# Altium project Project-C_LED.PrjPCB (part 2 of 2)
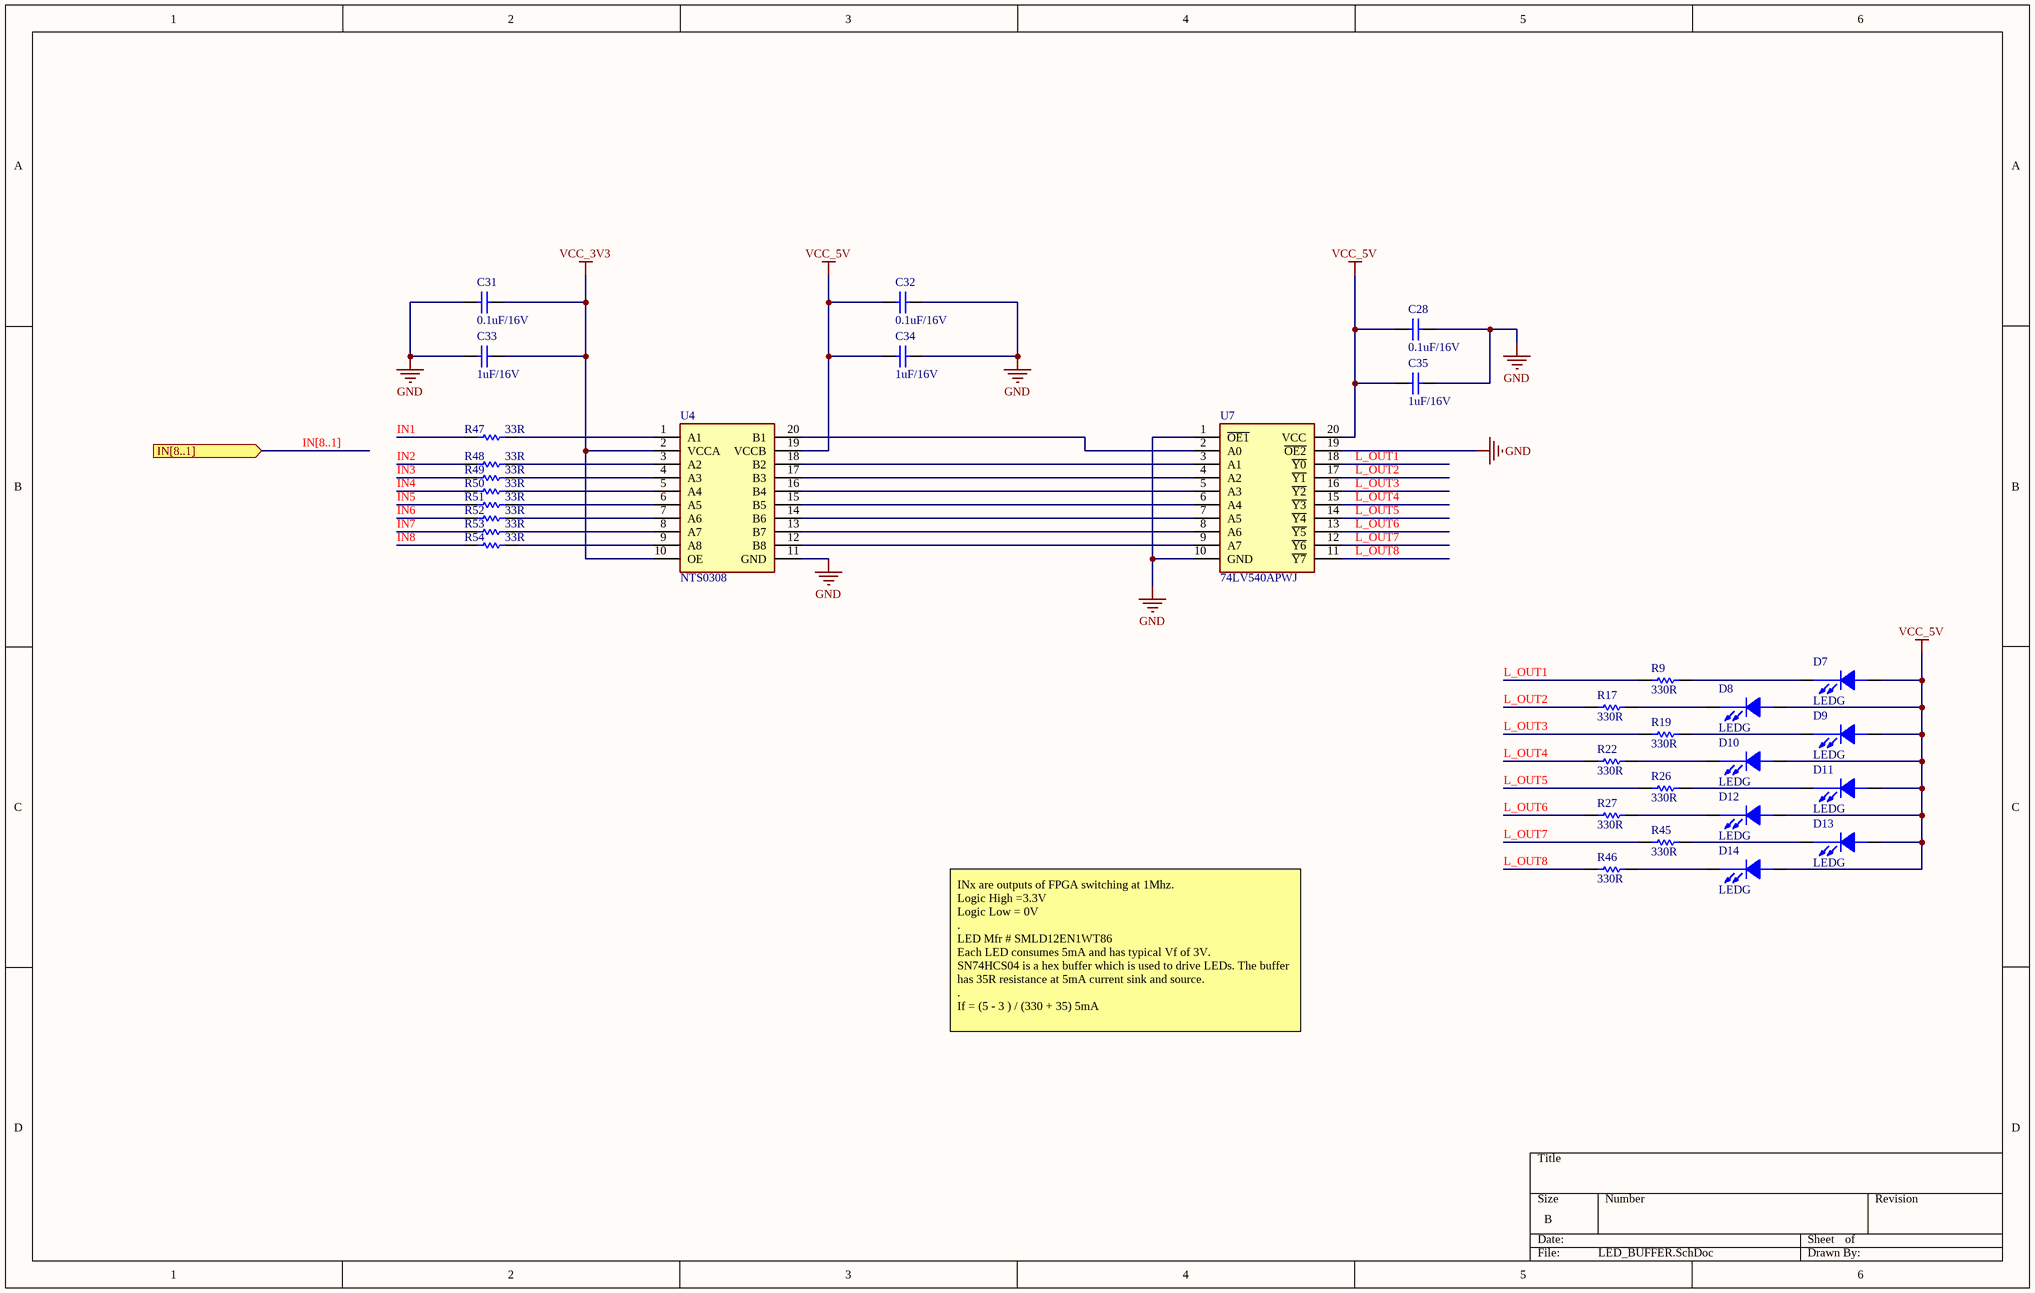
[diagram p8: LED_BUFFER.SchDoc]

## Nets that join several sheets
GND: TOP_LED (27 pins), F1/IO (19 pins), F1/POWER (42 pins), Power (11 pins), F2/IO (19 pins), F2/POWER (42 pins), F3/IO (19 pins), F3/POWER (42 pins), F4/IO (19 pins), F4/POWER (42 pins), Power_ORing (14 pins), U_LED_BUFFER_1xFPGA1/U_LED_BUFFER1 (10 pins), U_LED_BUFFER_1xFPGA1/U_LED_BUFFER2 (10 pins), U_LED_BUFFER_1xFPGA1/U_LED_BUFFER3 (10 pins), U_LED_BUFFER_1xFPGA1/U_LED_BUFFER4 (10 pins), U_LED_BUFFER_1xFPGA1/U_LED_BUFFER5 (10 pins), U_LED_BUFFER_1xFPGA1/U_LED_BUFFER6 (10 pins), U_LED_BUFFER_1xFPGA1/U_LED_BUFFER7 (10 pins), U_LED_BUFFER_1xFPGA1/U_LED_BUFFER8 (10 pins), U_LED_BUFFER_1xFPGA1/U_LED_BUFFER9 (10 pins), U_LED_BUFFER_1xFPGA1/U_LED_BUFFER10 (10 pins), U_LED_BUFFER_1xFPGA2/U_LED_BUFFER1 (10 pins), U_LED_BUFFER_1xFPGA2/U_LED_BUFFER2 (10 pins), U_LED_BUFFER_1xFPGA2/U_LED_BUFFER3 (10 pins), U_LED_BUFFER_1xFPGA2/U_LED_BUFFER4 (10 pins), U_LED_BUFFER_1xFPGA2/U_LED_BUFFER5 (10 pins), U_LED_BUFFER_1xFPGA2/U_LED_BUFFER6 (10 pins), U_LED_BUFFER_1xFPGA2/U_LED_BUFFER7 (10 pins), U_LED_BUFFER_1xFPGA2/U_LED_BUFFER8 (10 pins), U_LED_BUFFER_1xFPGA2/U_LED_BUFFER9 (10 pins), U_LED_BUFFER_1xFPGA2/U_LED_BUFFER10 (10 pins), U_LED_BUFFER_1xFPGA3/U_LED_BUFFER1 (10 pins), U_LED_BUFFER_1xFPGA3/U_LED_BUFFER2 (10 pins), U_LED_BUFFER_1xFPGA3/U_LED_BUFFER3 (10 pins), U_LED_BUFFER_1xFPGA3/U_LED_BUFFER4 (10 pins), U_LED_BUFFER_1xFPGA3/U_LED_BUFFER5 (10 pins), U_LED_BUFFER_1xFPGA3/U_LED_BUFFER6 (10 pins), U_LED_BUFFER_1xFPGA3/U_LED_BUFFER7 (10 pins), U_LED_BUFFER_1xFPGA3/U_LED_BUFFER8 (10 pins), U_LED_BUFFER_1xFPGA3/U_LED_BUFFER9 (10 pins), U_LED_BUFFER_1xFPGA3/U_LED_BUFFER10 (10 pins), U_LED_BUFFER_1xFPGA4/U_LED_BUFFER1 (10 pins), U_LED_BUFFER_1xFPGA4/U_LED_BUFFER2 (10 pins), U_LED_BUFFER_1xFPGA4/U_LED_BUFFER3 (10 pins), U_LED_BUFFER_1xFPGA4/U_LED_BUFFER4 (10 pins), U_LED_BUFFER_1xFPGA4/U_LED_BUFFER5 (10 pins), U_LED_BUFFER_1xFPGA4/U_LED_BUFFER6 (10 pins), U_LED_BUFFER_1xFPGA4/U_LED_BUFFER7 (10 pins), U_LED_BUFFER_1xFPGA4/U_LED_BUFFER8 (10 pins), U_LED_BUFFER_1xFPGA4/U_LED_BUFFER9 (10 pins), U_LED_BUFFER_1xFPGA4/U_LED_BUFFER10 (10 pins)
PWR_CNTRL: TOP_LED (J1.7 J1.8), Power_ORing (6 pins)
VCC_3V3: TOP_LED (7 pins), F1/IO (C1_F1_IO.2 U1_F1_IO.1 U1_F1_IO.4), F1/POWER (L1_F1_POWER.1 L3_F1_POWER.1), Power (C30.2 U6.4), F2/IO (C1_F2_IO.2 U1_F2_IO.1 U1_F2_IO.4), F2/POWER (L1_F2_POWER.1 L3_F2_POWER.1), F3/IO (C1_F3_IO.2 U1_F3_IO.1 U1_F3_IO.4), F3/POWER (L1_F3_POWER.1 L3_F3_POWER.1), F4/IO (C1_F4_IO.2 U1_F4_IO.1 U1_F4_IO.4), F4/POWER (L1_F4_POWER.1 L3_F4_POWER.1), U_LED_BUFFER_1xFPGA1/U_LED_BUFFER1 (C31_U_LED_BUFFER_1xFPGA1_U_LED_BUFFER1.2 C33_U_LED_BUFFER_1xFPGA1_U_LED_BUFFER1.2 U4_U_LED_BUFFER_1xFPGA1_U_LED_BUFFER1.2 U4_U_LED_BUFFER_1xFPGA1_U_LED_BUFFER1.10), U_LED_BUFFER_1xFPGA1/U_LED_BUFFER2 (C31_U_LED_BUFFER_1xFPGA1_U_LED_BUFFER2.2 C33_U_LED_BUFFER_1xFPGA1_U_LED_BUFFER2.2 U4_U_LED_BUFFER_1xFPGA1_U_LED_BUFFER2.2 U4_U_LED_BUFFER_1xFPGA1_U_LED_BUFFER2.10), U_LED_BUFFER_1xFPGA1/U_LED_BUFFER3 (C31_U_LED_BUFFER_1xFPGA1_U_LED_BUFFER3.2 C33_U_LED_BUFFER_1xFPGA1_U_LED_BUFFER3.2 U4_U_LED_BUFFER_1xFPGA1_U_LED_BUFFER3.2 U4_U_LED_BUFFER_1xFPGA1_U_LED_BUFFER3.10), U_LED_BUFFER_1xFPGA1/U_LED_BUFFER4 (C31_U_LED_BUFFER_1xFPGA1_U_LED_BUFFER4.2 C33_U_LED_BUFFER_1xFPGA1_U_LED_BUFFER4.2 U4_U_LED_BUFFER_1xFPGA1_U_LED_BUFFER4.2 U4_U_LED_BUFFER_1xFPGA1_U_LED_BUFFER4.10), U_LED_BUFFER_1xFPGA1/U_LED_BUFFER5 (C31_U_LED_BUFFER_1xFPGA1_U_LED_BUFFER5.2 C33_U_LED_BUFFER_1xFPGA1_U_LED_BUFFER5.2 U4_U_LED_BUFFER_1xFPGA1_U_LED_BUFFER5.2 U4_U_LED_BUFFER_1xFPGA1_U_LED_BUFFER5.10), U_LED_BUFFER_1xFPGA1/U_LED_BUFFER6 (C31_U_LED_BUFFER_1xFPGA1_U_LED_BUFFER6.2 C33_U_LED_BUFFER_1xFPGA1_U_LED_BUFFER6.2 U4_U_LED_BUFFER_1xFPGA1_U_LED_BUFFER6.2 U4_U_LED_BUFFER_1xFPGA1_U_LED_BUFFER6.10), U_LED_BUFFER_1xFPGA1/U_LED_BUFFER7 (C31_U_LED_BUFFER_1xFPGA1_U_LED_BUFFER7.2 C33_U_LED_BUFFER_1xFPGA1_U_LED_BUFFER7.2 U4_U_LED_BUFFER_1xFPGA1_U_LED_BUFFER7.2 U4_U_LED_BUFFER_1xFPGA1_U_LED_BUFFER7.10), U_LED_BUFFER_1xFPGA1/U_LED_BUFFER8 (C31_U_LED_BUFFER_1xFPGA1_U_LED_BUFFER8.2 C33_U_LED_BUFFER_1xFPGA1_U_LED_BUFFER8.2 U4_U_LED_BUFFER_1xFPGA1_U_LED_BUFFER8.2 U4_U_LED_BUFFER_1xFPGA1_U_LED_BUFFER8.10), U_LED_BUFFER_1xFPGA1/U_LED_BUFFER9 (C31_U_LED_BUFFER_1xFPGA1_U_LED_BUFFER9.2 C33_U_LED_BUFFER_1xFPGA1_U_LED_BUFFER9.2 U4_U_LED_BUFFER_1xFPGA1_U_LED_BUFFER9.2 U4_U_LED_BUFFER_1xFPGA1_U_LED_BUFFER9.10), U_LED_BUFFER_1xFPGA1/U_LED_BUFFER10 (C31_U_LED_BUFFER_1xFPGA1_U_LED_BUFFER10.2 C33_U_LED_BUFFER_1xFPGA1_U_LED_BUFFER10.2 U4_U_LED_BUFFER_1xFPGA1_U_LED_BUFFER10.2 U4_U_LED_BUFFER_1xFPGA1_U_LED_BUFFER10.10), U_LED_BUFFER_1xFPGA2/U_LED_BUFFER1 (C31_U_LED_BUFFER_1xFPGA2_U_LED_BUFFER1.2 C33_U_LED_BUFFER_1xFPGA2_U_LED_BUFFER1.2 U4_U_LED_BUFFER_1xFPGA2_U_LED_BUFFER1.2 U4_U_LED_BUFFER_1xFPGA2_U_LED_BUFFER1.10), U_LED_BUFFER_1xFPGA2/U_LED_BUFFER2 (C31_U_LED_BUFFER_1xFPGA2_U_LED_BUFFER2.2 C33_U_LED_BUFFER_1xFPGA2_U_LED_BUFFER2.2 U4_U_LED_BUFFER_1xFPGA2_U_LED_BUFFER2.2 U4_U_LED_BUFFER_1xFPGA2_U_LED_BUFFER2.10), U_LED_BUFFER_1xFPGA2/U_LED_BUFFER3 (C31_U_LED_BUFFER_1xFPGA2_U_LED_BUFFER3.2 C33_U_LED_BUFFER_1xFPGA2_U_LED_BUFFER3.2 U4_U_LED_BUFFER_1xFPGA2_U_LED_BUFFER3.2 U4_U_LED_BUFFER_1xFPGA2_U_LED_BUFFER3.10), U_LED_BUFFER_1xFPGA2/U_LED_BUFFER4 (C31_U_LED_BUFFER_1xFPGA2_U_LED_BUFFER4.2 C33_U_LED_BUFFER_1xFPGA2_U_LED_BUFFER4.2 U4_U_LED_BUFFER_1xFPGA2_U_LED_BUFFER4.2 U4_U_LED_BUFFER_1xFPGA2_U_LED_BUFFER4.10), U_LED_BUFFER_1xFPGA2/U_LED_BUFFER5 (C31_U_LED_BUFFER_1xFPGA2_U_LED_BUFFER5.2 C33_U_LED_BUFFER_1xFPGA2_U_LED_BUFFER5.2 U4_U_LED_BUFFER_1xFPGA2_U_LED_BUFFER5.2 U4_U_LED_BUFFER_1xFPGA2_U_LED_BUFFER5.10), U_LED_BUFFER_1xFPGA2/U_LED_BUFFER6 (C31_U_LED_BUFFER_1xFPGA2_U_LED_BUFFER6.2 C33_U_LED_BUFFER_1xFPGA2_U_LED_BUFFER6.2 U4_U_LED_BUFFER_1xFPGA2_U_LED_BUFFER6.2 U4_U_LED_BUFFER_1xFPGA2_U_LED_BUFFER6.10), U_LED_BUFFER_1xFPGA2/U_LED_BUFFER7 (C31_U_LED_BUFFER_1xFPGA2_U_LED_BUFFER7.2 C33_U_LED_BUFFER_1xFPGA2_U_LED_BUFFER7.2 U4_U_LED_BUFFER_1xFPGA2_U_LED_BUFFER7.2 U4_U_LED_BUFFER_1xFPGA2_U_LED_BUFFER7.10), U_LED_BUFFER_1xFPGA2/U_LED_BUFFER8 (C31_U_LED_BUFFER_1xFPGA2_U_LED_BUFFER8.2 C33_U_LED_BUFFER_1xFPGA2_U_LED_BUFFER8.2 U4_U_LED_BUFFER_1xFPGA2_U_LED_BUFFER8.2 U4_U_LED_BUFFER_1xFPGA2_U_LED_BUFFER8.10), U_LED_BUFFER_1xFPGA2/U_LED_BUFFER9 (C31_U_LED_BUFFER_1xFPGA2_U_LED_BUFFER9.2 C33_U_LED_BUFFER_1xFPGA2_U_LED_BUFFER9.2 U4_U_LED_BUFFER_1xFPGA2_U_LED_BUFFER9.2 U4_U_LED_BUFFER_1xFPGA2_U_LED_BUFFER9.10), U_LED_BUFFER_1xFPGA2/U_LED_BUFFER10 (C31_U_LED_BUFFER_1xFPGA2_U_LED_BUFFER10.2 C33_U_LED_BUFFER_1xFPGA2_U_LED_BUFFER10.2 U4_U_LED_BUFFER_1xFPGA2_U_LED_BUFFER10.2 U4_U_LED_BUFFER_1xFPGA2_U_LED_BUFFER10.10), U_LED_BUFFER_1xFPGA3/U_LED_BUFFER1 (C31_U_LED_BUFFER_1xFPGA3_U_LED_BUFFER1.2 C33_U_LED_BUFFER_1xFPGA3_U_LED_BUFFER1.2 U4_U_LED_BUFFER_1xFPGA3_U_LED_BUFFER1.2 U4_U_LED_BUFFER_1xFPGA3_U_LED_BUFFER1.10), U_LED_BUFFER_1xFPGA3/U_LED_BUFFER2 (C31_U_LED_BUFFER_1xFPGA3_U_LED_BUFFER2.2 C33_U_LED_BUFFER_1xFPGA3_U_LED_BUFFER2.2 U4_U_LED_BUFFER_1xFPGA3_U_LED_BUFFER2.2 U4_U_LED_BUFFER_1xFPGA3_U_LED_BUFFER2.10), U_LED_BUFFER_1xFPGA3/U_LED_BUFFER3 (C31_U_LED_BUFFER_1xFPGA3_U_LED_BUFFER3.2 C33_U_LED_BUFFER_1xFPGA3_U_LED_BUFFER3.2 U4_U_LED_BUFFER_1xFPGA3_U_LED_BUFFER3.2 U4_U_LED_BUFFER_1xFPGA3_U_LED_BUFFER3.10), U_LED_BUFFER_1xFPGA3/U_LED_BUFFER4 (C31_U_LED_BUFFER_1xFPGA3_U_LED_BUFFER4.2 C33_U_LED_BUFFER_1xFPGA3_U_LED_BUFFER4.2 U4_U_LED_BUFFER_1xFPGA3_U_LED_BUFFER4.2 U4_U_LED_BUFFER_1xFPGA3_U_LED_BUFFER4.10), U_LED_BUFFER_1xFPGA3/U_LED_BUFFER5 (C31_U_LED_BUFFER_1xFPGA3_U_LED_BUFFER5.2 C33_U_LED_BUFFER_1xFPGA3_U_LED_BUFFER5.2 U4_U_LED_BUFFER_1xFPGA3_U_LED_BUFFER5.2 U4_U_LED_BUFFER_1xFPGA3_U_LED_BUFFER5.10), U_LED_BUFFER_1xFPGA3/U_LED_BUFFER6 (C31_U_LED_BUFFER_1xFPGA3_U_LED_BUFFER6.2 C33_U_LED_BUFFER_1xFPGA3_U_LED_BUFFER6.2 U4_U_LED_BUFFER_1xFPGA3_U_LED_BUFFER6.2 U4_U_LED_BUFFER_1xFPGA3_U_LED_BUFFER6.10), U_LED_BUFFER_1xFPGA3/U_LED_BUFFER7 (C31_U_LED_BUFFER_1xFPGA3_U_LED_BUFFER7.2 C33_U_LED_BUFFER_1xFPGA3_U_LED_BUFFER7.2 U4_U_LED_BUFFER_1xFPGA3_U_LED_BUFFER7.2 U4_U_LED_BUFFER_1xFPGA3_U_LED_BUFFER7.10), U_LED_BUFFER_1xFPGA3/U_LED_BUFFER8 (C31_U_LED_BUFFER_1xFPGA3_U_LED_BUFFER8.2 C33_U_LED_BUFFER_1xFPGA3_U_LED_BUFFER8.2 U4_U_LED_BUFFER_1xFPGA3_U_LED_BUFFER8.2 U4_U_LED_BUFFER_1xFPGA3_U_LED_BUFFER8.10), U_LED_BUFFER_1xFPGA3/U_LED_BUFFER9 (C31_U_LED_BUFFER_1xFPGA3_U_LED_BUFFER9.2 C33_U_LED_BUFFER_1xFPGA3_U_LED_BUFFER9.2 U4_U_LED_BUFFER_1xFPGA3_U_LED_BUFFER9.2 U4_U_LED_BUFFER_1xFPGA3_U_LED_BUFFER9.10), U_LED_BUFFER_1xFPGA3/U_LED_BUFFER10 (C31_U_LED_BUFFER_1xFPGA3_U_LED_BUFFER10.2 C33_U_LED_BUFFER_1xFPGA3_U_LED_BUFFER10.2 U4_U_LED_BUFFER_1xFPGA3_U_LED_BUFFER10.2 U4_U_LED_BUFFER_1xFPGA3_U_LED_BUFFER10.10), U_LED_BUFFER_1xFPGA4/U_LED_BUFFER1 (C31_U_LED_BUFFER_1xFPGA4_U_LED_BUFFER1.2 C33_U_LED_BUFFER_1xFPGA4_U_LED_BUFFER1.2 U4_U_LED_BUFFER_1xFPGA4_U_LED_BUFFER1.2 U4_U_LED_BUFFER_1xFPGA4_U_LED_BUFFER1.10), U_LED_BUFFER_1xFPGA4/U_LED_BUFFER2 (C31_U_LED_BUFFER_1xFPGA4_U_LED_BUFFER2.2 C33_U_LED_BUFFER_1xFPGA4_U_LED_BUFFER2.2 U4_U_LED_BUFFER_1xFPGA4_U_LED_BUFFER2.2 U4_U_LED_BUFFER_1xFPGA4_U_LED_BUFFER2.10), U_LED_BUFFER_1xFPGA4/U_LED_BUFFER3 (C31_U_LED_BUFFER_1xFPGA4_U_LED_BUFFER3.2 C33_U_LED_BUFFER_1xFPGA4_U_LED_BUFFER3.2 U4_U_LED_BUFFER_1xFPGA4_U_LED_BUFFER3.2 U4_U_LED_BUFFER_1xFPGA4_U_LED_BUFFER3.10), U_LED_BUFFER_1xFPGA4/U_LED_BUFFER4 (C31_U_LED_BUFFER_1xFPGA4_U_LED_BUFFER4.2 C33_U_LED_BUFFER_1xFPGA4_U_LED_BUFFER4.2 U4_U_LED_BUFFER_1xFPGA4_U_LED_BUFFER4.2 U4_U_LED_BUFFER_1xFPGA4_U_LED_BUFFER4.10), U_LED_BUFFER_1xFPGA4/U_LED_BUFFER5 (C31_U_LED_BUFFER_1xFPGA4_U_LED_BUFFER5.2 C33_U_LED_BUFFER_1xFPGA4_U_LED_BUFFER5.2 U4_U_LED_BUFFER_1xFPGA4_U_LED_BUFFER5.2 U4_U_LED_BUFFER_1xFPGA4_U_LED_BUFFER5.10), U_LED_BUFFER_1xFPGA4/U_LED_BUFFER6 (C31_U_LED_BUFFER_1xFPGA4_U_LED_BUFFER6.2 C33_U_LED_BUFFER_1xFPGA4_U_LED_BUFFER6.2 U4_U_LED_BUFFER_1xFPGA4_U_LED_BUFFER6.2 U4_U_LED_BUFFER_1xFPGA4_U_LED_BUFFER6.10), U_LED_BUFFER_1xFPGA4/U_LED_BUFFER7 (C31_U_LED_BUFFER_1xFPGA4_U_LED_BUFFER7.2 C33_U_LED_BUFFER_1xFPGA4_U_LED_BUFFER7.2 U4_U_LED_BUFFER_1xFPGA4_U_LED_BUFFER7.2 U4_U_LED_BUFFER_1xFPGA4_U_LED_BUFFER7.10), U_LED_BUFFER_1xFPGA4/U_LED_BUFFER8 (C31_U_LED_BUFFER_1xFPGA4_U_LED_BUFFER8.2 C33_U_LED_BUFFER_1xFPGA4_U_LED_BUFFER8.2 U4_U_LED_BUFFER_1xFPGA4_U_LED_BUFFER8.2 U4_U_LED_BUFFER_1xFPGA4_U_LED_BUFFER8.10), U_LED_BUFFER_1xFPGA4/U_LED_BUFFER9 (C31_U_LED_BUFFER_1xFPGA4_U_LED_BUFFER9.2 C33_U_LED_BUFFER_1xFPGA4_U_LED_BUFFER9.2 U4_U_LED_BUFFER_1xFPGA4_U_LED_BUFFER9.2 U4_U_LED_BUFFER_1xFPGA4_U_LED_BUFFER9.10), U_LED_BUFFER_1xFPGA4/U_LED_BUFFER10 (C31_U_LED_BUFFER_1xFPGA4_U_LED_BUFFER10.2 C33_U_LED_BUFFER_1xFPGA4_U_LED_BUFFER10.2 U4_U_LED_BUFFER_1xFPGA4_U_LED_BUFFER10.2 U4_U_LED_BUFFER_1xFPGA4_U_LED_BUFFER10.10)
VCC_5V: Power (7 pins), U_LED_BUFFER_1xFPGA1/U_LED_BUFFER1 (14 pins), U_LED_BUFFER_1xFPGA1/U_LED_BUFFER2 (14 pins), U_LED_BUFFER_1xFPGA1/U_LED_BUFFER3 (14 pins), U_LED_BUFFER_1xFPGA1/U_LED_BUFFER4 (14 pins), U_LED_BUFFER_1xFPGA1/U_LED_BUFFER5 (14 pins), U_LED_BUFFER_1xFPGA1/U_LED_BUFFER6 (14 pins), U_LED_BUFFER_1xFPGA1/U_LED_BUFFER7 (14 pins), U_LED_BUFFER_1xFPGA1/U_LED_BUFFER8 (14 pins), U_LED_BUFFER_1xFPGA1/U_LED_BUFFER9 (14 pins), U_LED_BUFFER_1xFPGA1/U_LED_BUFFER10 (14 pins), U_LED_BUFFER_1xFPGA2/U_LED_BUFFER1 (14 pins), U_LED_BUFFER_1xFPGA2/U_LED_BUFFER2 (14 pins), U_LED_BUFFER_1xFPGA2/U_LED_BUFFER3 (14 pins), U_LED_BUFFER_1xFPGA2/U_LED_BUFFER4 (14 pins), U_LED_BUFFER_1xFPGA2/U_LED_BUFFER5 (14 pins), U_LED_BUFFER_1xFPGA2/U_LED_BUFFER6 (14 pins), U_LED_BUFFER_1xFPGA2/U_LED_BUFFER7 (14 pins), U_LED_BUFFER_1xFPGA2/U_LED_BUFFER8 (14 pins), U_LED_BUFFER_1xFPGA2/U_LED_BUFFER9 (14 pins), U_LED_BUFFER_1xFPGA2/U_LED_BUFFER10 (14 pins), U_LED_BUFFER_1xFPGA3/U_LED_BUFFER1 (14 pins), U_LED_BUFFER_1xFPGA3/U_LED_BUFFER2 (14 pins), U_LED_BUFFER_1xFPGA3/U_LED_BUFFER3 (14 pins), U_LED_BUFFER_1xFPGA3/U_LED_BUFFER4 (14 pins), U_LED_BUFFER_1xFPGA3/U_LED_BUFFER5 (14 pins), U_LED_BUFFER_1xFPGA3/U_LED_BUFFER6 (14 pins), U_LED_BUFFER_1xFPGA3/U_LED_BUFFER7 (14 pins), U_LED_BUFFER_1xFPGA3/U_LED_BUFFER8 (14 pins), U_LED_BUFFER_1xFPGA3/U_LED_BUFFER9 (14 pins), U_LED_BUFFER_1xFPGA3/U_LED_BUFFER10 (14 pins), U_LED_BUFFER_1xFPGA4/U_LED_BUFFER1 (14 pins), U_LED_BUFFER_1xFPGA4/U_LED_BUFFER2 (14 pins), U_LED_BUFFER_1xFPGA4/U_LED_BUFFER3 (14 pins), U_LED_BUFFER_1xFPGA4/U_LED_BUFFER4 (14 pins), U_LED_BUFFER_1xFPGA4/U_LED_BUFFER5 (14 pins), U_LED_BUFFER_1xFPGA4/U_LED_BUFFER6 (14 pins), U_LED_BUFFER_1xFPGA4/U_LED_BUFFER7 (14 pins), U_LED_BUFFER_1xFPGA4/U_LED_BUFFER8 (14 pins), U_LED_BUFFER_1xFPGA4/U_LED_BUFFER9 (14 pins), U_LED_BUFFER_1xFPGA4/U_LED_BUFFER10 (14 pins)
VCC_12V: Power (C19.2 C20.2 R15.2 U3.2), Power_ORing (7 pins)
BANK_EN0: TOP_LED (U14.11), F1/IO (P1_F1_IO.17)
BANK_EN1: TOP_LED (U14.10), F1/IO (P1_F1_IO.30)
CMD_INT: F1/IO (P1_F1_IO.61), F2/IO (P1_F2_IO.61), F3/IO (P1_F3_IO.61), F4/IO (P1_F4_IO.61)
CMD_RX: TOP_LED (U2.9), F1/IO (P1_F1_IO.98), F2/IO (P1_F2_IO.98), F3/IO (P1_F3_IO.98), F4/IO (P1_F4_IO.98)
CMD_TX: TOP_LED (U14.1), F4/IO (P1_F4_IO.96)
CMD_TX: TOP_LED (U14.2), F3/IO (P1_F3_IO.96)
CMD_TX: TOP_LED (U14.3), F2/IO (P1_F2_IO.96)
CMD_TX: TOP_LED (U14.4), F1/IO (P1_F1_IO.96)
GPIO_0: F1/IO (P1_F1_IO.14), U_LED_BUFFER_1xFPGA1/U_LED_BUFFER1 (R47_U_LED_BUFFER_1xFPGA1_U_LED_BUFFER1.2)
GPIO_0: F2/IO (P1_F2_IO.14), U_LED_BUFFER_1xFPGA2/U_LED_BUFFER1 (R47_U_LED_BUFFER_1xFPGA2_U_LED_BUFFER1.2)
GPIO_0: F3/IO (P1_F3_IO.14), U_LED_BUFFER_1xFPGA3/U_LED_BUFFER1 (R47_U_LED_BUFFER_1xFPGA3_U_LED_BUFFER1.2)
GPIO_0: F4/IO (P1_F4_IO.14), U_LED_BUFFER_1xFPGA4/U_LED_BUFFER1 (R47_U_LED_BUFFER_1xFPGA4_U_LED_BUFFER1.2)
GPIO_1: F1/IO (P1_F1_IO.13), U_LED_BUFFER_1xFPGA1/U_LED_BUFFER1 (R48_U_LED_BUFFER_1xFPGA1_U_LED_BUFFER1.2)
GPIO_1: F2/IO (P1_F2_IO.13), U_LED_BUFFER_1xFPGA2/U_LED_BUFFER1 (R48_U_LED_BUFFER_1xFPGA2_U_LED_BUFFER1.2)
GPIO_1: F3/IO (P1_F3_IO.13), U_LED_BUFFER_1xFPGA3/U_LED_BUFFER1 (R48_U_LED_BUFFER_1xFPGA3_U_LED_BUFFER1.2)
GPIO_1: F4/IO (P1_F4_IO.13), U_LED_BUFFER_1xFPGA4/U_LED_BUFFER1 (R48_U_LED_BUFFER_1xFPGA4_U_LED_BUFFER1.2)
GPIO_2: F1/IO (P1_F1_IO.12), U_LED_BUFFER_1xFPGA1/U_LED_BUFFER1 (R49_U_LED_BUFFER_1xFPGA1_U_LED_BUFFER1.2)
GPIO_2: F2/IO (P1_F2_IO.12), U_LED_BUFFER_1xFPGA2/U_LED_BUFFER1 (R49_U_LED_BUFFER_1xFPGA2_U_LED_BUFFER1.2)
GPIO_2: F3/IO (P1_F3_IO.12), U_LED_BUFFER_1xFPGA3/U_LED_BUFFER1 (R49_U_LED_BUFFER_1xFPGA3_U_LED_BUFFER1.2)
GPIO_2: F4/IO (P1_F4_IO.12), U_LED_BUFFER_1xFPGA4/U_LED_BUFFER1 (R49_U_LED_BUFFER_1xFPGA4_U_LED_BUFFER1.2)
GPIO_3: F1/IO (P1_F1_IO.11), U_LED_BUFFER_1xFPGA1/U_LED_BUFFER1 (R50_U_LED_BUFFER_1xFPGA1_U_LED_BUFFER1.2)
GPIO_3: F2/IO (P1_F2_IO.11), U_LED_BUFFER_1xFPGA2/U_LED_BUFFER1 (R50_U_LED_BUFFER_1xFPGA2_U_LED_BUFFER1.2)
GPIO_3: F3/IO (P1_F3_IO.11), U_LED_BUFFER_1xFPGA3/U_LED_BUFFER1 (R50_U_LED_BUFFER_1xFPGA3_U_LED_BUFFER1.2)
GPIO_3: F4/IO (P1_F4_IO.11), U_LED_BUFFER_1xFPGA4/U_LED_BUFFER1 (R50_U_LED_BUFFER_1xFPGA4_U_LED_BUFFER1.2)
GPIO_4: F1/IO (P1_F1_IO.10), U_LED_BUFFER_1xFPGA1/U_LED_BUFFER1 (R51_U_LED_BUFFER_1xFPGA1_U_LED_BUFFER1.2)
GPIO_4: F2/IO (P1_F2_IO.10), U_LED_BUFFER_1xFPGA2/U_LED_BUFFER1 (R51_U_LED_BUFFER_1xFPGA2_U_LED_BUFFER1.2)
GPIO_4: F3/IO (P1_F3_IO.10), U_LED_BUFFER_1xFPGA3/U_LED_BUFFER1 (R51_U_LED_BUFFER_1xFPGA3_U_LED_BUFFER1.2)
GPIO_4: F4/IO (P1_F4_IO.10), U_LED_BUFFER_1xFPGA4/U_LED_BUFFER1 (R51_U_LED_BUFFER_1xFPGA4_U_LED_BUFFER1.2)
GPIO_5: F1/IO (P1_F1_IO.8), U_LED_BUFFER_1xFPGA1/U_LED_BUFFER1 (R52_U_LED_BUFFER_1xFPGA1_U_LED_BUFFER1.2)
GPIO_5: F2/IO (P1_F2_IO.8), U_LED_BUFFER_1xFPGA2/U_LED_BUFFER1 (R52_U_LED_BUFFER_1xFPGA2_U_LED_BUFFER1.2)
GPIO_5: F3/IO (P1_F3_IO.8), U_LED_BUFFER_1xFPGA3/U_LED_BUFFER1 (R52_U_LED_BUFFER_1xFPGA3_U_LED_BUFFER1.2)
GPIO_5: F4/IO (P1_F4_IO.8), U_LED_BUFFER_1xFPGA4/U_LED_BUFFER1 (R52_U_LED_BUFFER_1xFPGA4_U_LED_BUFFER1.2)
GPIO_6: F1/IO (P1_F1_IO.7), U_LED_BUFFER_1xFPGA1/U_LED_BUFFER1 (R53_U_LED_BUFFER_1xFPGA1_U_LED_BUFFER1.2)
GPIO_6: F2/IO (P1_F2_IO.7), U_LED_BUFFER_1xFPGA2/U_LED_BUFFER1 (R53_U_LED_BUFFER_1xFPGA2_U_LED_BUFFER1.2)
GPIO_6: F3/IO (P1_F3_IO.7), U_LED_BUFFER_1xFPGA3/U_LED_BUFFER1 (R53_U_LED_BUFFER_1xFPGA3_U_LED_BUFFER1.2)
GPIO_6: F4/IO (P1_F4_IO.7), U_LED_BUFFER_1xFPGA4/U_LED_BUFFER1 (R53_U_LED_BUFFER_1xFPGA4_U_LED_BUFFER1.2)
GPIO_7: F1/IO (P1_F1_IO.6), U_LED_BUFFER_1xFPGA1/U_LED_BUFFER1 (R54_U_LED_BUFFER_1xFPGA1_U_LED_BUFFER1.2)
GPIO_7: F2/IO (P1_F2_IO.6), U_LED_BUFFER_1xFPGA2/U_LED_BUFFER1 (R54_U_LED_BUFFER_1xFPGA2_U_LED_BUFFER1.2)
GPIO_7: F3/IO (P1_F3_IO.6), U_LED_BUFFER_1xFPGA3/U_LED_BUFFER1 (R54_U_LED_BUFFER_1xFPGA3_U_LED_BUFFER1.2)
GPIO_7: F4/IO (P1_F4_IO.6), U_LED_BUFFER_1xFPGA4/U_LED_BUFFER1 (R54_U_LED_BUFFER_1xFPGA4_U_LED_BUFFER1.2)
GPIO_8: F1/IO (P1_F1_IO.39), U_LED_BUFFER_1xFPGA1/U_LED_BUFFER2 (R47_U_LED_BUFFER_1xFPGA1_U_LED_BUFFER2.2)
GPIO_8: F2/IO (P1_F2_IO.39), U_LED_BUFFER_1xFPGA2/U_LED_BUFFER2 (R47_U_LED_BUFFER_1xFPGA2_U_LED_BUFFER2.2)
GPIO_8: F3/IO (P1_F3_IO.39), U_LED_BUFFER_1xFPGA3/U_LED_BUFFER2 (R47_U_LED_BUFFER_1xFPGA3_U_LED_BUFFER2.2)
GPIO_8: F4/IO (P1_F4_IO.39), U_LED_BUFFER_1xFPGA4/U_LED_BUFFER2 (R47_U_LED_BUFFER_1xFPGA4_U_LED_BUFFER2.2)
GPIO_9: F1/IO (P1_F1_IO.38), U_LED_BUFFER_1xFPGA1/U_LED_BUFFER2 (R48_U_LED_BUFFER_1xFPGA1_U_LED_BUFFER2.2)
GPIO_9: F2/IO (P1_F2_IO.38), U_LED_BUFFER_1xFPGA2/U_LED_BUFFER2 (R48_U_LED_BUFFER_1xFPGA2_U_LED_BUFFER2.2)
GPIO_9: F3/IO (P1_F3_IO.38), U_LED_BUFFER_1xFPGA3/U_LED_BUFFER2 (R48_U_LED_BUFFER_1xFPGA3_U_LED_BUFFER2.2)
GPIO_9: F4/IO (P1_F4_IO.38), U_LED_BUFFER_1xFPGA4/U_LED_BUFFER2 (R48_U_LED_BUFFER_1xFPGA4_U_LED_BUFFER2.2)
GPIO_10: F1/IO (P1_F1_IO.29), U_LED_BUFFER_1xFPGA1/U_LED_BUFFER2 (R49_U_LED_BUFFER_1xFPGA1_U_LED_BUFFER2.2)
GPIO_10: F2/IO (P1_F2_IO.29), U_LED_BUFFER_1xFPGA2/U_LED_BUFFER2 (R49_U_LED_BUFFER_1xFPGA2_U_LED_BUFFER2.2)
GPIO_10: F3/IO (P1_F3_IO.29), U_LED_BUFFER_1xFPGA3/U_LED_BUFFER2 (R49_U_LED_BUFFER_1xFPGA3_U_LED_BUFFER2.2)
GPIO_10: F4/IO (P1_F4_IO.29), U_LED_BUFFER_1xFPGA4/U_LED_BUFFER2 (R49_U_LED_BUFFER_1xFPGA4_U_LED_BUFFER2.2)
GPIO_11: F1/IO (P1_F1_IO.28), U_LED_BUFFER_1xFPGA1/U_LED_BUFFER2 (R50_U_LED_BUFFER_1xFPGA1_U_LED_BUFFER2.2)
GPIO_11: F2/IO (P1_F2_IO.28), U_LED_BUFFER_1xFPGA2/U_LED_BUFFER2 (R50_U_LED_BUFFER_1xFPGA2_U_LED_BUFFER2.2)
GPIO_11: F3/IO (P1_F3_IO.28), U_LED_BUFFER_1xFPGA3/U_LED_BUFFER2 (R50_U_LED_BUFFER_1xFPGA3_U_LED_BUFFER2.2)
GPIO_11: F4/IO (P1_F4_IO.28), U_LED_BUFFER_1xFPGA4/U_LED_BUFFER2 (R50_U_LED_BUFFER_1xFPGA4_U_LED_BUFFER2.2)
GPIO_12: F1/IO (P1_F1_IO.25), U_LED_BUFFER_1xFPGA1/U_LED_BUFFER2 (R51_U_LED_BUFFER_1xFPGA1_U_LED_BUFFER2.2)
GPIO_12: F2/IO (P1_F2_IO.25), U_LED_BUFFER_1xFPGA2/U_LED_BUFFER2 (R51_U_LED_BUFFER_1xFPGA2_U_LED_BUFFER2.2)
GPIO_12: F3/IO (P1_F3_IO.25), U_LED_BUFFER_1xFPGA3/U_LED_BUFFER2 (R51_U_LED_BUFFER_1xFPGA3_U_LED_BUFFER2.2)
GPIO_12: F4/IO (P1_F4_IO.25), U_LED_BUFFER_1xFPGA4/U_LED_BUFFER2 (R51_U_LED_BUFFER_1xFPGA4_U_LED_BUFFER2.2)
GPIO_13: F1/IO (P1_F1_IO.24), U_LED_BUFFER_1xFPGA1/U_LED_BUFFER2 (R52_U_LED_BUFFER_1xFPGA1_U_LED_BUFFER2.2)
GPIO_13: F2/IO (P1_F2_IO.24), U_LED_BUFFER_1xFPGA2/U_LED_BUFFER2 (R52_U_LED_BUFFER_1xFPGA2_U_LED_BUFFER2.2)
GPIO_13: F3/IO (P1_F3_IO.24), U_LED_BUFFER_1xFPGA3/U_LED_BUFFER2 (R52_U_LED_BUFFER_1xFPGA3_U_LED_BUFFER2.2)
GPIO_13: F4/IO (P1_F4_IO.24), U_LED_BUFFER_1xFPGA4/U_LED_BUFFER2 (R52_U_LED_BUFFER_1xFPGA4_U_LED_BUFFER2.2)
GPIO_14: F1/IO (P1_F1_IO.22), U_LED_BUFFER_1xFPGA1/U_LED_BUFFER2 (R53_U_LED_BUFFER_1xFPGA1_U_LED_BUFFER2.2)
GPIO_14: F2/IO (P1_F2_IO.22), U_LED_BUFFER_1xFPGA2/U_LED_BUFFER2 (R53_U_LED_BUFFER_1xFPGA2_U_LED_BUFFER2.2)
GPIO_14: F3/IO (P1_F3_IO.22), U_LED_BUFFER_1xFPGA3/U_LED_BUFFER2 (R53_U_LED_BUFFER_1xFPGA3_U_LED_BUFFER2.2)
GPIO_14: F4/IO (P1_F4_IO.22), U_LED_BUFFER_1xFPGA4/U_LED_BUFFER2 (R53_U_LED_BUFFER_1xFPGA4_U_LED_BUFFER2.2)
GPIO_15: F1/IO (P1_F1_IO.21), U_LED_BUFFER_1xFPGA1/U_LED_BUFFER2 (R54_U_LED_BUFFER_1xFPGA1_U_LED_BUFFER2.2)
GPIO_15: F2/IO (P1_F2_IO.21), U_LED_BUFFER_1xFPGA2/U_LED_BUFFER2 (R54_U_LED_BUFFER_1xFPGA2_U_LED_BUFFER2.2)
GPIO_15: F3/IO (P1_F3_IO.21), U_LED_BUFFER_1xFPGA3/U_LED_BUFFER2 (R54_U_LED_BUFFER_1xFPGA3_U_LED_BUFFER2.2)
GPIO_15: F4/IO (P1_F4_IO.21), U_LED_BUFFER_1xFPGA4/U_LED_BUFFER2 (R54_U_LED_BUFFER_1xFPGA4_U_LED_BUFFER2.2)
GPIO_16: F1/IO (P1_F1_IO.120), U_LED_BUFFER_1xFPGA1/U_LED_BUFFER3 (R47_U_LED_BUFFER_1xFPGA1_U_LED_BUFFER3.2)
GPIO_16: F2/IO (P1_F2_IO.120), U_LED_BUFFER_1xFPGA2/U_LED_BUFFER3 (R47_U_LED_BUFFER_1xFPGA2_U_LED_BUFFER3.2)
GPIO_16: F3/IO (P1_F3_IO.120), U_LED_BUFFER_1xFPGA3/U_LED_BUFFER3 (R47_U_LED_BUFFER_1xFPGA3_U_LED_BUFFER3.2)
GPIO_16: F4/IO (P1_F4_IO.120), U_LED_BUFFER_1xFPGA4/U_LED_BUFFER3 (R47_U_LED_BUFFER_1xFPGA4_U_LED_BUFFER3.2)
GPIO_17: F1/IO (P1_F1_IO.119), U_LED_BUFFER_1xFPGA1/U_LED_BUFFER3 (R48_U_LED_BUFFER_1xFPGA1_U_LED_BUFFER3.2)
GPIO_17: F2/IO (P1_F2_IO.119), U_LED_BUFFER_1xFPGA2/U_LED_BUFFER3 (R48_U_LED_BUFFER_1xFPGA2_U_LED_BUFFER3.2)
GPIO_17: F3/IO (P1_F3_IO.119), U_LED_BUFFER_1xFPGA3/U_LED_BUFFER3 (R48_U_LED_BUFFER_1xFPGA3_U_LED_BUFFER3.2)
GPIO_17: F4/IO (P1_F4_IO.119), U_LED_BUFFER_1xFPGA4/U_LED_BUFFER3 (R48_U_LED_BUFFER_1xFPGA4_U_LED_BUFFER3.2)
GPIO_18: F1/IO (P1_F1_IO.118), U_LED_BUFFER_1xFPGA1/U_LED_BUFFER3 (R49_U_LED_BUFFER_1xFPGA1_U_LED_BUFFER3.2)
GPIO_18: F2/IO (P1_F2_IO.118), U_LED_BUFFER_1xFPGA2/U_LED_BUFFER3 (R49_U_LED_BUFFER_1xFPGA2_U_LED_BUFFER3.2)
GPIO_18: F3/IO (P1_F3_IO.118), U_LED_BUFFER_1xFPGA3/U_LED_BUFFER3 (R49_U_LED_BUFFER_1xFPGA3_U_LED_BUFFER3.2)
GPIO_18: F4/IO (P1_F4_IO.118), U_LED_BUFFER_1xFPGA4/U_LED_BUFFER3 (R49_U_LED_BUFFER_1xFPGA4_U_LED_BUFFER3.2)
GPIO_19: F1/IO (P1_F1_IO.114), U_LED_BUFFER_1xFPGA1/U_LED_BUFFER3 (R50_U_LED_BUFFER_1xFPGA1_U_LED_BUFFER3.2)
GPIO_19: F2/IO (P1_F2_IO.114), U_LED_BUFFER_1xFPGA2/U_LED_BUFFER3 (R50_U_LED_BUFFER_1xFPGA2_U_LED_BUFFER3.2)
GPIO_19: F3/IO (P1_F3_IO.114), U_LED_BUFFER_1xFPGA3/U_LED_BUFFER3 (R50_U_LED_BUFFER_1xFPGA3_U_LED_BUFFER3.2)
GPIO_19: F4/IO (P1_F4_IO.114), U_LED_BUFFER_1xFPGA4/U_LED_BUFFER3 (R50_U_LED_BUFFER_1xFPGA4_U_LED_BUFFER3.2)
GPIO_20: F1/IO (P1_F1_IO.113), U_LED_BUFFER_1xFPGA1/U_LED_BUFFER3 (R51_U_LED_BUFFER_1xFPGA1_U_LED_BUFFER3.2)
GPIO_20: F2/IO (P1_F2_IO.113), U_LED_BUFFER_1xFPGA2/U_LED_BUFFER3 (R51_U_LED_BUFFER_1xFPGA2_U_LED_BUFFER3.2)
GPIO_20: F3/IO (P1_F3_IO.113), U_LED_BUFFER_1xFPGA3/U_LED_BUFFER3 (R51_U_LED_BUFFER_1xFPGA3_U_LED_BUFFER3.2)
GPIO_20: F4/IO (P1_F4_IO.113), U_LED_BUFFER_1xFPGA4/U_LED_BUFFER3 (R51_U_LED_BUFFER_1xFPGA4_U_LED_BUFFER3.2)
GPIO_21: F1/IO (P1_F1_IO.111), U_LED_BUFFER_1xFPGA1/U_LED_BUFFER3 (R52_U_LED_BUFFER_1xFPGA1_U_LED_BUFFER3.2)
GPIO_21: F2/IO (P1_F2_IO.111), U_LED_BUFFER_1xFPGA2/U_LED_BUFFER3 (R52_U_LED_BUFFER_1xFPGA2_U_LED_BUFFER3.2)
GPIO_21: F3/IO (P1_F3_IO.111), U_LED_BUFFER_1xFPGA3/U_LED_BUFFER3 (R52_U_LED_BUFFER_1xFPGA3_U_LED_BUFFER3.2)
GPIO_21: F4/IO (P1_F4_IO.111), U_LED_BUFFER_1xFPGA4/U_LED_BUFFER3 (R52_U_LED_BUFFER_1xFPGA4_U_LED_BUFFER3.2)
GPIO_22: F1/IO (P1_F1_IO.110), U_LED_BUFFER_1xFPGA1/U_LED_BUFFER3 (R53_U_LED_BUFFER_1xFPGA1_U_LED_BUFFER3.2)
GPIO_22: F2/IO (P1_F2_IO.110), U_LED_BUFFER_1xFPGA2/U_LED_BUFFER3 (R53_U_LED_BUFFER_1xFPGA2_U_LED_BUFFER3.2)
GPIO_22: F3/IO (P1_F3_IO.110), U_LED_BUFFER_1xFPGA3/U_LED_BUFFER3 (R53_U_LED_BUFFER_1xFPGA3_U_LED_BUFFER3.2)
GPIO_22: F4/IO (P1_F4_IO.110), U_LED_BUFFER_1xFPGA4/U_LED_BUFFER3 (R53_U_LED_BUFFER_1xFPGA4_U_LED_BUFFER3.2)
GPIO_23: F1/IO (P1_F1_IO.106), U_LED_BUFFER_1xFPGA1/U_LED_BUFFER3 (R54_U_LED_BUFFER_1xFPGA1_U_LED_BUFFER3.2)
GPIO_23: F2/IO (P1_F2_IO.106), U_LED_BUFFER_1xFPGA2/U_LED_BUFFER3 (R54_U_LED_BUFFER_1xFPGA2_U_LED_BUFFER3.2)
GPIO_23: F3/IO (P1_F3_IO.106), U_LED_BUFFER_1xFPGA3/U_LED_BUFFER3 (R54_U_LED_BUFFER_1xFPGA3_U_LED_BUFFER3.2)
GPIO_23: F4/IO (P1_F4_IO.106), U_LED_BUFFER_1xFPGA4/U_LED_BUFFER3 (R54_U_LED_BUFFER_1xFPGA4_U_LED_BUFFER3.2)
GPIO_24: F1/IO (P1_F1_IO.52), U_LED_BUFFER_1xFPGA1/U_LED_BUFFER4 (R47_U_LED_BUFFER_1xFPGA1_U_LED_BUFFER4.2)
GPIO_24: F2/IO (P1_F2_IO.52), U_LED_BUFFER_1xFPGA2/U_LED_BUFFER4 (R47_U_LED_BUFFER_1xFPGA2_U_LED_BUFFER4.2)
GPIO_24: F3/IO (P1_F3_IO.52), U_LED_BUFFER_1xFPGA3/U_LED_BUFFER4 (R47_U_LED_BUFFER_1xFPGA3_U_LED_BUFFER4.2)
GPIO_24: F4/IO (P1_F4_IO.52), U_LED_BUFFER_1xFPGA4/U_LED_BUFFER4 (R47_U_LED_BUFFER_1xFPGA4_U_LED_BUFFER4.2)
GPIO_25: F1/IO (P1_F1_IO.50), U_LED_BUFFER_1xFPGA1/U_LED_BUFFER4 (R48_U_LED_BUFFER_1xFPGA1_U_LED_BUFFER4.2)
GPIO_25: F2/IO (P1_F2_IO.50), U_LED_BUFFER_1xFPGA2/U_LED_BUFFER4 (R48_U_LED_BUFFER_1xFPGA2_U_LED_BUFFER4.2)
GPIO_25: F3/IO (P1_F3_IO.50), U_LED_BUFFER_1xFPGA3/U_LED_BUFFER4 (R48_U_LED_BUFFER_1xFPGA3_U_LED_BUFFER4.2)
GPIO_25: F4/IO (P1_F4_IO.50), U_LED_BUFFER_1xFPGA4/U_LED_BUFFER4 (R48_U_LED_BUFFER_1xFPGA4_U_LED_BUFFER4.2)
GPIO_26: F1/IO (P1_F1_IO.47), U_LED_BUFFER_1xFPGA1/U_LED_BUFFER4 (R49_U_LED_BUFFER_1xFPGA1_U_LED_BUFFER4.2)
GPIO_26: F2/IO (P1_F2_IO.47), U_LED_BUFFER_1xFPGA2/U_LED_BUFFER4 (R49_U_LED_BUFFER_1xFPGA2_U_LED_BUFFER4.2)
GPIO_26: F3/IO (P1_F3_IO.47), U_LED_BUFFER_1xFPGA3/U_LED_BUFFER4 (R49_U_LED_BUFFER_1xFPGA3_U_LED_BUFFER4.2)
GPIO_26: F4/IO (P1_F4_IO.47), U_LED_BUFFER_1xFPGA4/U_LED_BUFFER4 (R49_U_LED_BUFFER_1xFPGA4_U_LED_BUFFER4.2)
GPIO_27: F1/IO (P1_F1_IO.46), U_LED_BUFFER_1xFPGA1/U_LED_BUFFER4 (R50_U_LED_BUFFER_1xFPGA1_U_LED_BUFFER4.2)
GPIO_27: F2/IO (P1_F2_IO.46), U_LED_BUFFER_1xFPGA2/U_LED_BUFFER4 (R50_U_LED_BUFFER_1xFPGA2_U_LED_BUFFER4.2)
GPIO_27: F3/IO (P1_F3_IO.46), U_LED_BUFFER_1xFPGA3/U_LED_BUFFER4 (R50_U_LED_BUFFER_1xFPGA3_U_LED_BUFFER4.2)
GPIO_27: F4/IO (P1_F4_IO.46), U_LED_BUFFER_1xFPGA4/U_LED_BUFFER4 (R50_U_LED_BUFFER_1xFPGA4_U_LED_BUFFER4.2)
GPIO_28: F1/IO (P1_F1_IO.45), U_LED_BUFFER_1xFPGA1/U_LED_BUFFER4 (R51_U_LED_BUFFER_1xFPGA1_U_LED_BUFFER4.2)
GPIO_28: F2/IO (P1_F2_IO.45), U_LED_BUFFER_1xFPGA2/U_LED_BUFFER4 (R51_U_LED_BUFFER_1xFPGA2_U_LED_BUFFER4.2)
GPIO_28: F3/IO (P1_F3_IO.45), U_LED_BUFFER_1xFPGA3/U_LED_BUFFER4 (R51_U_LED_BUFFER_1xFPGA3_U_LED_BUFFER4.2)
GPIO_28: F4/IO (P1_F4_IO.45), U_LED_BUFFER_1xFPGA4/U_LED_BUFFER4 (R51_U_LED_BUFFER_1xFPGA4_U_LED_BUFFER4.2)
GPIO_29: F1/IO (P1_F1_IO.44), U_LED_BUFFER_1xFPGA1/U_LED_BUFFER4 (R52_U_LED_BUFFER_1xFPGA1_U_LED_BUFFER4.2)
GPIO_29: F2/IO (P1_F2_IO.44), U_LED_BUFFER_1xFPGA2/U_LED_BUFFER4 (R52_U_LED_BUFFER_1xFPGA2_U_LED_BUFFER4.2)
GPIO_29: F3/IO (P1_F3_IO.44), U_LED_BUFFER_1xFPGA3/U_LED_BUFFER4 (R52_U_LED_BUFFER_1xFPGA3_U_LED_BUFFER4.2)
GPIO_29: F4/IO (P1_F4_IO.44), U_LED_BUFFER_1xFPGA4/U_LED_BUFFER4 (R52_U_LED_BUFFER_1xFPGA4_U_LED_BUFFER4.2)
GPIO_30: F1/IO (P1_F1_IO.43), U_LED_BUFFER_1xFPGA1/U_LED_BUFFER4 (R53_U_LED_BUFFER_1xFPGA1_U_LED_BUFFER4.2)
GPIO_30: F2/IO (P1_F2_IO.43), U_LED_BUFFER_1xFPGA2/U_LED_BUFFER4 (R53_U_LED_BUFFER_1xFPGA2_U_LED_BUFFER4.2)
GPIO_30: F3/IO (P1_F3_IO.43), U_LED_BUFFER_1xFPGA3/U_LED_BUFFER4 (R53_U_LED_BUFFER_1xFPGA3_U_LED_BUFFER4.2)
GPIO_30: F4/IO (P1_F4_IO.43), U_LED_BUFFER_1xFPGA4/U_LED_BUFFER4 (R53_U_LED_BUFFER_1xFPGA4_U_LED_BUFFER4.2)
GPIO_31: F1/IO (P1_F1_IO.41), U_LED_BUFFER_1xFPGA1/U_LED_BUFFER4 (R54_U_LED_BUFFER_1xFPGA1_U_LED_BUFFER4.2)
GPIO_31: F2/IO (P1_F2_IO.41), U_LED_BUFFER_1xFPGA2/U_LED_BUFFER4 (R54_U_LED_BUFFER_1xFPGA2_U_LED_BUFFER4.2)
GPIO_31: F3/IO (P1_F3_IO.41), U_LED_BUFFER_1xFPGA3/U_LED_BUFFER4 (R54_U_LED_BUFFER_1xFPGA3_U_LED_BUFFER4.2)
GPIO_31: F4/IO (P1_F4_IO.41), U_LED_BUFFER_1xFPGA4/U_LED_BUFFER4 (R54_U_LED_BUFFER_1xFPGA4_U_LED_BUFFER4.2)
GPIO_32: F1/IO (P1_F1_IO.62), U_LED_BUFFER_1xFPGA1/U_LED_BUFFER5 (R47_U_LED_BUFFER_1xFPGA1_U_LED_BUFFER5.2)
GPIO_32: F2/IO (P1_F2_IO.62), U_LED_BUFFER_1xFPGA2/U_LED_BUFFER5 (R47_U_LED_BUFFER_1xFPGA2_U_LED_BUFFER5.2)
GPIO_32: F3/IO (P1_F3_IO.62), U_LED_BUFFER_1xFPGA3/U_LED_BUFFER5 (R47_U_LED_BUFFER_1xFPGA3_U_LED_BUFFER5.2)
GPIO_32: F4/IO (P1_F4_IO.62), U_LED_BUFFER_1xFPGA4/U_LED_BUFFER5 (R47_U_LED_BUFFER_1xFPGA4_U_LED_BUFFER5.2)
GPIO_33: F1/IO (P1_F1_IO.60), U_LED_BUFFER_1xFPGA1/U_LED_BUFFER5 (R48_U_LED_BUFFER_1xFPGA1_U_LED_BUFFER5.2)
GPIO_33: F2/IO (P1_F2_IO.60), U_LED_BUFFER_1xFPGA2/U_LED_BUFFER5 (R48_U_LED_BUFFER_1xFPGA2_U_LED_BUFFER5.2)
GPIO_33: F3/IO (P1_F3_IO.60), U_LED_BUFFER_1xFPGA3/U_LED_BUFFER5 (R48_U_LED_BUFFER_1xFPGA3_U_LED_BUFFER5.2)
GPIO_33: F4/IO (P1_F4_IO.60), U_LED_BUFFER_1xFPGA4/U_LED_BUFFER5 (R48_U_LED_BUFFER_1xFPGA4_U_LED_BUFFER5.2)
GPIO_34: F1/IO (P1_F1_IO.59), U_LED_BUFFER_1xFPGA1/U_LED_BUFFER5 (R49_U_LED_BUFFER_1xFPGA1_U_LED_BUFFER5.2)
GPIO_34: F2/IO (P1_F2_IO.59), U_LED_BUFFER_1xFPGA2/U_LED_BUFFER5 (R49_U_LED_BUFFER_1xFPGA2_U_LED_BUFFER5.2)
GPIO_34: F3/IO (P1_F3_IO.59), U_LED_BUFFER_1xFPGA3/U_LED_BUFFER5 (R49_U_LED_BUFFER_1xFPGA3_U_LED_BUFFER5.2)
GPIO_34: F4/IO (P1_F4_IO.59), U_LED_BUFFER_1xFPGA4/U_LED_BUFFER5 (R49_U_LED_BUFFER_1xFPGA4_U_LED_BUFFER5.2)
GPIO_35: F1/IO (P1_F1_IO.58), U_LED_BUFFER_1xFPGA1/U_LED_BUFFER5 (R50_U_LED_BUFFER_1xFPGA1_U_LED_BUFFER5.2)
GPIO_35: F2/IO (P1_F2_IO.58), U_LED_BUFFER_1xFPGA2/U_LED_BUFFER5 (R50_U_LED_BUFFER_1xFPGA2_U_LED_BUFFER5.2)
GPIO_35: F3/IO (P1_F3_IO.58), U_LED_BUFFER_1xFPGA3/U_LED_BUFFER5 (R50_U_LED_BUFFER_1xFPGA3_U_LED_BUFFER5.2)
GPIO_35: F4/IO (P1_F4_IO.58), U_LED_BUFFER_1xFPGA4/U_LED_BUFFER5 (R50_U_LED_BUFFER_1xFPGA4_U_LED_BUFFER5.2)
GPIO_36: F1/IO (P1_F1_IO.57), U_LED_BUFFER_1xFPGA1/U_LED_BUFFER5 (R51_U_LED_BUFFER_1xFPGA1_U_LED_BUFFER5.2)
GPIO_36: F2/IO (P1_F2_IO.57), U_LED_BUFFER_1xFPGA2/U_LED_BUFFER5 (R51_U_LED_BUFFER_1xFPGA2_U_LED_BUFFER5.2)
GPIO_36: F3/IO (P1_F3_IO.57), U_LED_BUFFER_1xFPGA3/U_LED_BUFFER5 (R51_U_LED_BUFFER_1xFPGA3_U_LED_BUFFER5.2)
GPIO_36: F4/IO (P1_F4_IO.57), U_LED_BUFFER_1xFPGA4/U_LED_BUFFER5 (R51_U_LED_BUFFER_1xFPGA4_U_LED_BUFFER5.2)
GPIO_37: F1/IO (P1_F1_IO.56), U_LED_BUFFER_1xFPGA1/U_LED_BUFFER5 (R52_U_LED_BUFFER_1xFPGA1_U_LED_BUFFER5.2)
GPIO_37: F2/IO (P1_F2_IO.56), U_LED_BUFFER_1xFPGA2/U_LED_BUFFER5 (R52_U_LED_BUFFER_1xFPGA2_U_LED_BUFFER5.2)
GPIO_37: F3/IO (P1_F3_IO.56), U_LED_BUFFER_1xFPGA3/U_LED_BUFFER5 (R52_U_LED_BUFFER_1xFPGA3_U_LED_BUFFER5.2)
GPIO_37: F4/IO (P1_F4_IO.56), U_LED_BUFFER_1xFPGA4/U_LED_BUFFER5 (R52_U_LED_BUFFER_1xFPGA4_U_LED_BUFFER5.2)
GPIO_38: F1/IO (P1_F1_IO.55), U_LED_BUFFER_1xFPGA1/U_LED_BUFFER5 (R53_U_LED_BUFFER_1xFPGA1_U_LED_BUFFER5.2)
GPIO_38: F2/IO (P1_F2_IO.55), U_LED_BUFFER_1xFPGA2/U_LED_BUFFER5 (R53_U_LED_BUFFER_1xFPGA2_U_LED_BUFFER5.2)
GPIO_38: F3/IO (P1_F3_IO.55), U_LED_BUFFER_1xFPGA3/U_LED_BUFFER5 (R53_U_LED_BUFFER_1xFPGA3_U_LED_BUFFER5.2)
GPIO_38: F4/IO (P1_F4_IO.55), U_LED_BUFFER_1xFPGA4/U_LED_BUFFER5 (R53_U_LED_BUFFER_1xFPGA4_U_LED_BUFFER5.2)
GPIO_39: F1/IO (P1_F1_IO.54), U_LED_BUFFER_1xFPGA1/U_LED_BUFFER5 (R54_U_LED_BUFFER_1xFPGA1_U_LED_BUFFER5.2)
GPIO_39: F2/IO (P1_F2_IO.54), U_LED_BUFFER_1xFPGA2/U_LED_BUFFER5 (R54_U_LED_BUFFER_1xFPGA2_U_LED_BUFFER5.2)
GPIO_39: F3/IO (P1_F3_IO.54), U_LED_BUFFER_1xFPGA3/U_LED_BUFFER5 (R54_U_LED_BUFFER_1xFPGA3_U_LED_BUFFER5.2)
GPIO_39: F4/IO (P1_F4_IO.54), U_LED_BUFFER_1xFPGA4/U_LED_BUFFER5 (R54_U_LED_BUFFER_1xFPGA4_U_LED_BUFFER5.2)
GPIO_40: F1/IO (P1_F1_IO.140), U_LED_BUFFER_1xFPGA1/U_LED_BUFFER6 (R47_U_LED_BUFFER_1xFPGA1_U_LED_BUFFER6.2)
GPIO_40: F2/IO (P1_F2_IO.140), U_LED_BUFFER_1xFPGA2/U_LED_BUFFER6 (R47_U_LED_BUFFER_1xFPGA2_U_LED_BUFFER6.2)
GPIO_40: F3/IO (P1_F3_IO.140), U_LED_BUFFER_1xFPGA3/U_LED_BUFFER6 (R47_U_LED_BUFFER_1xFPGA3_U_LED_BUFFER6.2)
GPIO_40: F4/IO (P1_F4_IO.140), U_LED_BUFFER_1xFPGA4/U_LED_BUFFER6 (R47_U_LED_BUFFER_1xFPGA4_U_LED_BUFFER6.2)
GPIO_41: F1/IO (P1_F1_IO.135), U_LED_BUFFER_1xFPGA1/U_LED_BUFFER6 (R48_U_LED_BUFFER_1xFPGA1_U_LED_BUFFER6.2)
GPIO_41: F2/IO (P1_F2_IO.135), U_LED_BUFFER_1xFPGA2/U_LED_BUFFER6 (R48_U_LED_BUFFER_1xFPGA2_U_LED_BUFFER6.2)
GPIO_41: F3/IO (P1_F3_IO.135), U_LED_BUFFER_1xFPGA3/U_LED_BUFFER6 (R48_U_LED_BUFFER_1xFPGA3_U_LED_BUFFER6.2)
GPIO_41: F4/IO (P1_F4_IO.135), U_LED_BUFFER_1xFPGA4/U_LED_BUFFER6 (R48_U_LED_BUFFER_1xFPGA4_U_LED_BUFFER6.2)
GPIO_42: F1/IO (P1_F1_IO.132), U_LED_BUFFER_1xFPGA1/U_LED_BUFFER6 (R49_U_LED_BUFFER_1xFPGA1_U_LED_BUFFER6.2)
GPIO_42: F2/IO (P1_F2_IO.132), U_LED_BUFFER_1xFPGA2/U_LED_BUFFER6 (R49_U_LED_BUFFER_1xFPGA2_U_LED_BUFFER6.2)
GPIO_42: F3/IO (P1_F3_IO.132), U_LED_BUFFER_1xFPGA3/U_LED_BUFFER6 (R49_U_LED_BUFFER_1xFPGA3_U_LED_BUFFER6.2)
GPIO_42: F4/IO (P1_F4_IO.132), U_LED_BUFFER_1xFPGA4/U_LED_BUFFER6 (R49_U_LED_BUFFER_1xFPGA4_U_LED_BUFFER6.2)
GPIO_43: F1/IO (P1_F1_IO.131), U_LED_BUFFER_1xFPGA1/U_LED_BUFFER6 (R50_U_LED_BUFFER_1xFPGA1_U_LED_BUFFER6.2)
GPIO_43: F2/IO (P1_F2_IO.131), U_LED_BUFFER_1xFPGA2/U_LED_BUFFER6 (R50_U_LED_BUFFER_1xFPGA2_U_LED_BUFFER6.2)
GPIO_43: F3/IO (P1_F3_IO.131), U_LED_BUFFER_1xFPGA3/U_LED_BUFFER6 (R50_U_LED_BUFFER_1xFPGA3_U_LED_BUFFER6.2)
GPIO_43: F4/IO (P1_F4_IO.131), U_LED_BUFFER_1xFPGA4/U_LED_BUFFER6 (R50_U_LED_BUFFER_1xFPGA4_U_LED_BUFFER6.2)
GPIO_44: F1/IO (P1_F1_IO.130), U_LED_BUFFER_1xFPGA1/U_LED_BUFFER6 (R51_U_LED_BUFFER_1xFPGA1_U_LED_BUFFER6.2)
GPIO_44: F2/IO (P1_F2_IO.130), U_LED_BUFFER_1xFPGA2/U_LED_BUFFER6 (R51_U_LED_BUFFER_1xFPGA2_U_LED_BUFFER6.2)
GPIO_44: F3/IO (P1_F3_IO.130), U_LED_BUFFER_1xFPGA3/U_LED_BUFFER6 (R51_U_LED_BUFFER_1xFPGA3_U_LED_BUFFER6.2)
GPIO_44: F4/IO (P1_F4_IO.130), U_LED_BUFFER_1xFPGA4/U_LED_BUFFER6 (R51_U_LED_BUFFER_1xFPGA4_U_LED_BUFFER6.2)
GPIO_45: F1/IO (P1_F1_IO.127), U_LED_BUFFER_1xFPGA1/U_LED_BUFFER6 (R52_U_LED_BUFFER_1xFPGA1_U_LED_BUFFER6.2)
GPIO_45: F2/IO (P1_F2_IO.127), U_LED_BUFFER_1xFPGA2/U_LED_BUFFER6 (R52_U_LED_BUFFER_1xFPGA2_U_LED_BUFFER6.2)
GPIO_45: F3/IO (P1_F3_IO.127), U_LED_BUFFER_1xFPGA3/U_LED_BUFFER6 (R52_U_LED_BUFFER_1xFPGA3_U_LED_BUFFER6.2)
GPIO_45: F4/IO (P1_F4_IO.127), U_LED_BUFFER_1xFPGA4/U_LED_BUFFER6 (R52_U_LED_BUFFER_1xFPGA4_U_LED_BUFFER6.2)
GPIO_46: F1/IO (P1_F1_IO.124), U_LED_BUFFER_1xFPGA1/U_LED_BUFFER6 (R53_U_LED_BUFFER_1xFPGA1_U_LED_BUFFER6.2)
GPIO_46: F2/IO (P1_F2_IO.124), U_LED_BUFFER_1xFPGA2/U_LED_BUFFER6 (R53_U_LED_BUFFER_1xFPGA2_U_LED_BUFFER6.2)
GPIO_46: F3/IO (P1_F3_IO.124), U_LED_BUFFER_1xFPGA3/U_LED_BUFFER6 (R53_U_LED_BUFFER_1xFPGA3_U_LED_BUFFER6.2)
GPIO_46: F4/IO (P1_F4_IO.124), U_LED_BUFFER_1xFPGA4/U_LED_BUFFER6 (R53_U_LED_BUFFER_1xFPGA4_U_LED_BUFFER6.2)
GPIO_47: F1/IO (P1_F1_IO.141), U_LED_BUFFER_1xFPGA1/U_LED_BUFFER6 (R54_U_LED_BUFFER_1xFPGA1_U_LED_BUFFER6.2)
GPIO_47: F2/IO (P1_F2_IO.141), U_LED_BUFFER_1xFPGA2/U_LED_BUFFER6 (R54_U_LED_BUFFER_1xFPGA2_U_LED_BUFFER6.2)
GPIO_47: F3/IO (P1_F3_IO.141), U_LED_BUFFER_1xFPGA3/U_LED_BUFFER6 (R54_U_LED_BUFFER_1xFPGA3_U_LED_BUFFER6.2)
GPIO_47: F4/IO (P1_F4_IO.141), U_LED_BUFFER_1xFPGA4/U_LED_BUFFER6 (R54_U_LED_BUFFER_1xFPGA4_U_LED_BUFFER6.2)
GPIO_48: F1/IO (P1_F1_IO.76), U_LED_BUFFER_1xFPGA1/U_LED_BUFFER7 (R47_U_LED_BUFFER_1xFPGA1_U_LED_BUFFER7.2)
GPIO_48: F2/IO (P1_F2_IO.76), U_LED_BUFFER_1xFPGA2/U_LED_BUFFER7 (R47_U_LED_BUFFER_1xFPGA2_U_LED_BUFFER7.2)
GPIO_48: F3/IO (P1_F3_IO.76), U_LED_BUFFER_1xFPGA3/U_LED_BUFFER7 (R47_U_LED_BUFFER_1xFPGA3_U_LED_BUFFER7.2)
GPIO_48: F4/IO (P1_F4_IO.76), U_LED_BUFFER_1xFPGA4/U_LED_BUFFER7 (R47_U_LED_BUFFER_1xFPGA4_U_LED_BUFFER7.2)
GPIO_49: F1/IO (P1_F1_IO.75), U_LED_BUFFER_1xFPGA1/U_LED_BUFFER7 (R48_U_LED_BUFFER_1xFPGA1_U_LED_BUFFER7.2)
GPIO_49: F2/IO (P1_F2_IO.75), U_LED_BUFFER_1xFPGA2/U_LED_BUFFER7 (R48_U_LED_BUFFER_1xFPGA2_U_LED_BUFFER7.2)
GPIO_49: F3/IO (P1_F3_IO.75), U_LED_BUFFER_1xFPGA3/U_LED_BUFFER7 (R48_U_LED_BUFFER_1xFPGA3_U_LED_BUFFER7.2)
GPIO_49: F4/IO (P1_F4_IO.75), U_LED_BUFFER_1xFPGA4/U_LED_BUFFER7 (R48_U_LED_BUFFER_1xFPGA4_U_LED_BUFFER7.2)
GPIO_50: F1/IO (P1_F1_IO.74), U_LED_BUFFER_1xFPGA1/U_LED_BUFFER7 (R49_U_LED_BUFFER_1xFPGA1_U_LED_BUFFER7.2)
GPIO_50: F2/IO (P1_F2_IO.74), U_LED_BUFFER_1xFPGA2/U_LED_BUFFER7 (R49_U_LED_BUFFER_1xFPGA2_U_LED_BUFFER7.2)
GPIO_50: F3/IO (P1_F3_IO.74), U_LED_BUFFER_1xFPGA3/U_LED_BUFFER7 (R49_U_LED_BUFFER_1xFPGA3_U_LED_BUFFER7.2)
GPIO_50: F4/IO (P1_F4_IO.74), U_LED_BUFFER_1xFPGA4/U_LED_BUFFER7 (R49_U_LED_BUFFER_1xFPGA4_U_LED_BUFFER7.2)
GPIO_51: F1/IO (P1_F1_IO.70), U_LED_BUFFER_1xFPGA1/U_LED_BUFFER7 (R50_U_LED_BUFFER_1xFPGA1_U_LED_BUFFER7.2)
GPIO_51: F2/IO (P1_F2_IO.70), U_LED_BUFFER_1xFPGA2/U_LED_BUFFER7 (R50_U_LED_BUFFER_1xFPGA2_U_LED_BUFFER7.2)
GPIO_51: F3/IO (P1_F3_IO.70), U_LED_BUFFER_1xFPGA3/U_LED_BUFFER7 (R50_U_LED_BUFFER_1xFPGA3_U_LED_BUFFER7.2)
GPIO_51: F4/IO (P1_F4_IO.70), U_LED_BUFFER_1xFPGA4/U_LED_BUFFER7 (R50_U_LED_BUFFER_1xFPGA4_U_LED_BUFFER7.2)
GPIO_52: F1/IO (P1_F1_IO.69), U_LED_BUFFER_1xFPGA1/U_LED_BUFFER7 (R51_U_LED_BUFFER_1xFPGA1_U_LED_BUFFER7.2)
GPIO_52: F2/IO (P1_F2_IO.69), U_LED_BUFFER_1xFPGA2/U_LED_BUFFER7 (R51_U_LED_BUFFER_1xFPGA2_U_LED_BUFFER7.2)
GPIO_52: F3/IO (P1_F3_IO.69), U_LED_BUFFER_1xFPGA3/U_LED_BUFFER7 (R51_U_LED_BUFFER_1xFPGA3_U_LED_BUFFER7.2)
GPIO_52: F4/IO (P1_F4_IO.69), U_LED_BUFFER_1xFPGA4/U_LED_BUFFER7 (R51_U_LED_BUFFER_1xFPGA4_U_LED_BUFFER7.2)
GPIO_53: F1/IO (P1_F1_IO.66), U_LED_BUFFER_1xFPGA1/U_LED_BUFFER7 (R52_U_LED_BUFFER_1xFPGA1_U_LED_BUFFER7.2)
GPIO_53: F2/IO (P1_F2_IO.66), U_LED_BUFFER_1xFPGA2/U_LED_BUFFER7 (R52_U_LED_BUFFER_1xFPGA2_U_LED_BUFFER7.2)
GPIO_53: F3/IO (P1_F3_IO.66), U_LED_BUFFER_1xFPGA3/U_LED_BUFFER7 (R52_U_LED_BUFFER_1xFPGA3_U_LED_BUFFER7.2)
GPIO_53: F4/IO (P1_F4_IO.66), U_LED_BUFFER_1xFPGA4/U_LED_BUFFER7 (R52_U_LED_BUFFER_1xFPGA4_U_LED_BUFFER7.2)
GPIO_54: F1/IO (P1_F1_IO.65), U_LED_BUFFER_1xFPGA1/U_LED_BUFFER7 (R53_U_LED_BUFFER_1xFPGA1_U_LED_BUFFER7.2)
GPIO_54: F2/IO (P1_F2_IO.65), U_LED_BUFFER_1xFPGA2/U_LED_BUFFER7 (R53_U_LED_BUFFER_1xFPGA2_U_LED_BUFFER7.2)
GPIO_54: F3/IO (P1_F3_IO.65), U_LED_BUFFER_1xFPGA3/U_LED_BUFFER7 (R53_U_LED_BUFFER_1xFPGA3_U_LED_BUFFER7.2)
GPIO_54: F4/IO (P1_F4_IO.65), U_LED_BUFFER_1xFPGA4/U_LED_BUFFER7 (R53_U_LED_BUFFER_1xFPGA4_U_LED_BUFFER7.2)
GPIO_55: F1/IO (P1_F1_IO.64), U_LED_BUFFER_1xFPGA1/U_LED_BUFFER7 (R54_U_LED_BUFFER_1xFPGA1_U_LED_BUFFER7.2)
GPIO_55: F2/IO (P1_F2_IO.64), U_LED_BUFFER_1xFPGA2/U_LED_BUFFER7 (R54_U_LED_BUFFER_1xFPGA2_U_LED_BUFFER7.2)
GPIO_55: F3/IO (P1_F3_IO.64), U_LED_BUFFER_1xFPGA3/U_LED_BUFFER7 (R54_U_LED_BUFFER_1xFPGA3_U_LED_BUFFER7.2)
GPIO_55: F4/IO (P1_F4_IO.64), U_LED_BUFFER_1xFPGA4/U_LED_BUFFER7 (R54_U_LED_BUFFER_1xFPGA4_U_LED_BUFFER7.2)
GPIO_56: F1/IO (P1_F1_IO.87), U_LED_BUFFER_1xFPGA1/U_LED_BUFFER8 (R47_U_LED_BUFFER_1xFPGA1_U_LED_BUFFER8.2)
GPIO_56: F2/IO (P1_F2_IO.87), U_LED_BUFFER_1xFPGA2/U_LED_BUFFER8 (R47_U_LED_BUFFER_1xFPGA2_U_LED_BUFFER8.2)
GPIO_56: F3/IO (P1_F3_IO.87), U_LED_BUFFER_1xFPGA3/U_LED_BUFFER8 (R47_U_LED_BUFFER_1xFPGA3_U_LED_BUFFER8.2)
GPIO_56: F4/IO (P1_F4_IO.87), U_LED_BUFFER_1xFPGA4/U_LED_BUFFER8 (R47_U_LED_BUFFER_1xFPGA4_U_LED_BUFFER8.2)
GPIO_57: F1/IO (P1_F1_IO.86), U_LED_BUFFER_1xFPGA1/U_LED_BUFFER8 (R48_U_LED_BUFFER_1xFPGA1_U_LED_BUFFER8.2)
GPIO_57: F2/IO (P1_F2_IO.86), U_LED_BUFFER_1xFPGA2/U_LED_BUFFER8 (R48_U_LED_BUFFER_1xFPGA2_U_LED_BUFFER8.2)
GPIO_57: F3/IO (P1_F3_IO.86), U_LED_BUFFER_1xFPGA3/U_LED_BUFFER8 (R48_U_LED_BUFFER_1xFPGA3_U_LED_BUFFER8.2)
GPIO_57: F4/IO (P1_F4_IO.86), U_LED_BUFFER_1xFPGA4/U_LED_BUFFER8 (R48_U_LED_BUFFER_1xFPGA4_U_LED_BUFFER8.2)
GPIO_58: F1/IO (P1_F1_IO.85), U_LED_BUFFER_1xFPGA1/U_LED_BUFFER8 (R49_U_LED_BUFFER_1xFPGA1_U_LED_BUFFER8.2)
GPIO_58: F2/IO (P1_F2_IO.85), U_LED_BUFFER_1xFPGA2/U_LED_BUFFER8 (R49_U_LED_BUFFER_1xFPGA2_U_LED_BUFFER8.2)
GPIO_58: F3/IO (P1_F3_IO.85), U_LED_BUFFER_1xFPGA3/U_LED_BUFFER8 (R49_U_LED_BUFFER_1xFPGA3_U_LED_BUFFER8.2)
GPIO_58: F4/IO (P1_F4_IO.85), U_LED_BUFFER_1xFPGA4/U_LED_BUFFER8 (R49_U_LED_BUFFER_1xFPGA4_U_LED_BUFFER8.2)
GPIO_59: F1/IO (P1_F1_IO.84), U_LED_BUFFER_1xFPGA1/U_LED_BUFFER8 (R50_U_LED_BUFFER_1xFPGA1_U_LED_BUFFER8.2)
GPIO_59: F2/IO (P1_F2_IO.84), U_LED_BUFFER_1xFPGA2/U_LED_BUFFER8 (R50_U_LED_BUFFER_1xFPGA2_U_LED_BUFFER8.2)
GPIO_59: F3/IO (P1_F3_IO.84), U_LED_BUFFER_1xFPGA3/U_LED_BUFFER8 (R50_U_LED_BUFFER_1xFPGA3_U_LED_BUFFER8.2)
GPIO_59: F4/IO (P1_F4_IO.84), U_LED_BUFFER_1xFPGA4/U_LED_BUFFER8 (R50_U_LED_BUFFER_1xFPGA4_U_LED_BUFFER8.2)
GPIO_60: F1/IO (P1_F1_IO.81), U_LED_BUFFER_1xFPGA1/U_LED_BUFFER8 (R51_U_LED_BUFFER_1xFPGA1_U_LED_BUFFER8.2)
GPIO_60: F2/IO (P1_F2_IO.81), U_LED_BUFFER_1xFPGA2/U_LED_BUFFER8 (R51_U_LED_BUFFER_1xFPGA2_U_LED_BUFFER8.2)
GPIO_60: F3/IO (P1_F3_IO.81), U_LED_BUFFER_1xFPGA3/U_LED_BUFFER8 (R51_U_LED_BUFFER_1xFPGA3_U_LED_BUFFER8.2)
GPIO_60: F4/IO (P1_F4_IO.81), U_LED_BUFFER_1xFPGA4/U_LED_BUFFER8 (R51_U_LED_BUFFER_1xFPGA4_U_LED_BUFFER8.2)
GPIO_61: F1/IO (P1_F1_IO.79), U_LED_BUFFER_1xFPGA1/U_LED_BUFFER8 (R52_U_LED_BUFFER_1xFPGA1_U_LED_BUFFER8.2)
GPIO_61: F2/IO (P1_F2_IO.79), U_LED_BUFFER_1xFPGA2/U_LED_BUFFER8 (R52_U_LED_BUFFER_1xFPGA2_U_LED_BUFFER8.2)
GPIO_61: F3/IO (P1_F3_IO.79), U_LED_BUFFER_1xFPGA3/U_LED_BUFFER8 (R52_U_LED_BUFFER_1xFPGA3_U_LED_BUFFER8.2)
GPIO_61: F4/IO (P1_F4_IO.79), U_LED_BUFFER_1xFPGA4/U_LED_BUFFER8 (R52_U_LED_BUFFER_1xFPGA4_U_LED_BUFFER8.2)
GPIO_62: F1/IO (P1_F1_IO.78), U_LED_BUFFER_1xFPGA1/U_LED_BUFFER8 (R53_U_LED_BUFFER_1xFPGA1_U_LED_BUFFER8.2)
GPIO_62: F2/IO (P1_F2_IO.78), U_LED_BUFFER_1xFPGA2/U_LED_BUFFER8 (R53_U_LED_BUFFER_1xFPGA2_U_LED_BUFFER8.2)
GPIO_62: F3/IO (P1_F3_IO.78), U_LED_BUFFER_1xFPGA3/U_LED_BUFFER8 (R53_U_LED_BUFFER_1xFPGA3_U_LED_BUFFER8.2)
GPIO_62: F4/IO (P1_F4_IO.78), U_LED_BUFFER_1xFPGA4/U_LED_BUFFER8 (R53_U_LED_BUFFER_1xFPGA4_U_LED_BUFFER8.2)
GPIO_63: F1/IO (P1_F1_IO.77), U_LED_BUFFER_1xFPGA1/U_LED_BUFFER8 (R54_U_LED_BUFFER_1xFPGA1_U_LED_BUFFER8.2)
GPIO_63: F2/IO (P1_F2_IO.77), U_LED_BUFFER_1xFPGA2/U_LED_BUFFER8 (R54_U_LED_BUFFER_1xFPGA2_U_LED_BUFFER8.2)
GPIO_63: F3/IO (P1_F3_IO.77), U_LED_BUFFER_1xFPGA3/U_LED_BUFFER8 (R54_U_LED_BUFFER_1xFPGA3_U_LED_BUFFER8.2)
GPIO_63: F4/IO (P1_F4_IO.77), U_LED_BUFFER_1xFPGA4/U_LED_BUFFER8 (R54_U_LED_BUFFER_1xFPGA4_U_LED_BUFFER8.2)
GPIO_64: F1/IO (P1_F1_IO.100), U_LED_BUFFER_1xFPGA1/U_LED_BUFFER9 (R47_U_LED_BUFFER_1xFPGA1_U_LED_BUFFER9.2)
GPIO_64: F2/IO (P1_F2_IO.100), U_LED_BUFFER_1xFPGA2/U_LED_BUFFER9 (R47_U_LED_BUFFER_1xFPGA2_U_LED_BUFFER9.2)
GPIO_64: F3/IO (P1_F3_IO.100), U_LED_BUFFER_1xFPGA3/U_LED_BUFFER9 (R47_U_LED_BUFFER_1xFPGA3_U_LED_BUFFER9.2)
GPIO_64: F4/IO (P1_F4_IO.100), U_LED_BUFFER_1xFPGA4/U_LED_BUFFER9 (R47_U_LED_BUFFER_1xFPGA4_U_LED_BUFFER9.2)
GPIO_65: F1/IO (P1_F1_IO.99), U_LED_BUFFER_1xFPGA1/U_LED_BUFFER9 (R48_U_LED_BUFFER_1xFPGA1_U_LED_BUFFER9.2)
GPIO_65: F2/IO (P1_F2_IO.99), U_LED_BUFFER_1xFPGA2/U_LED_BUFFER9 (R48_U_LED_BUFFER_1xFPGA2_U_LED_BUFFER9.2)
GPIO_65: F3/IO (P1_F3_IO.99), U_LED_BUFFER_1xFPGA3/U_LED_BUFFER9 (R48_U_LED_BUFFER_1xFPGA3_U_LED_BUFFER9.2)
GPIO_65: F4/IO (P1_F4_IO.99), U_LED_BUFFER_1xFPGA4/U_LED_BUFFER9 (R48_U_LED_BUFFER_1xFPGA4_U_LED_BUFFER9.2)
GPIO_66: F1/IO (P1_F1_IO.93), U_LED_BUFFER_1xFPGA1/U_LED_BUFFER9 (R49_U_LED_BUFFER_1xFPGA1_U_LED_BUFFER9.2)
GPIO_66: F2/IO (P1_F2_IO.93), U_LED_BUFFER_1xFPGA2/U_LED_BUFFER9 (R49_U_LED_BUFFER_1xFPGA2_U_LED_BUFFER9.2)
GPIO_66: F3/IO (P1_F3_IO.93), U_LED_BUFFER_1xFPGA3/U_LED_BUFFER9 (R49_U_LED_BUFFER_1xFPGA3_U_LED_BUFFER9.2)
GPIO_66: F4/IO (P1_F4_IO.93), U_LED_BUFFER_1xFPGA4/U_LED_BUFFER9 (R49_U_LED_BUFFER_1xFPGA4_U_LED_BUFFER9.2)
GPIO_67: F1/IO (P1_F1_IO.92), U_LED_BUFFER_1xFPGA1/U_LED_BUFFER9 (R50_U_LED_BUFFER_1xFPGA1_U_LED_BUFFER9.2)
GPIO_67: F2/IO (P1_F2_IO.92), U_LED_BUFFER_1xFPGA2/U_LED_BUFFER9 (R50_U_LED_BUFFER_1xFPGA2_U_LED_BUFFER9.2)
GPIO_67: F3/IO (P1_F3_IO.92), U_LED_BUFFER_1xFPGA3/U_LED_BUFFER9 (R50_U_LED_BUFFER_1xFPGA3_U_LED_BUFFER9.2)
GPIO_67: F4/IO (P1_F4_IO.92), U_LED_BUFFER_1xFPGA4/U_LED_BUFFER9 (R50_U_LED_BUFFER_1xFPGA4_U_LED_BUFFER9.2)
GPIO_68: F1/IO (P1_F1_IO.91), U_LED_BUFFER_1xFPGA1/U_LED_BUFFER9 (R51_U_LED_BUFFER_1xFPGA1_U_LED_BUFFER9.2)
GPIO_68: F2/IO (P1_F2_IO.91), U_LED_BUFFER_1xFPGA2/U_LED_BUFFER9 (R51_U_LED_BUFFER_1xFPGA2_U_LED_BUFFER9.2)
GPIO_68: F3/IO (P1_F3_IO.91), U_LED_BUFFER_1xFPGA3/U_LED_BUFFER9 (R51_U_LED_BUFFER_1xFPGA3_U_LED_BUFFER9.2)
GPIO_68: F4/IO (P1_F4_IO.91), U_LED_BUFFER_1xFPGA4/U_LED_BUFFER9 (R51_U_LED_BUFFER_1xFPGA4_U_LED_BUFFER9.2)
GPIO_69: F1/IO (P1_F1_IO.90), U_LED_BUFFER_1xFPGA1/U_LED_BUFFER9 (R52_U_LED_BUFFER_1xFPGA1_U_LED_BUFFER9.2)
GPIO_69: F2/IO (P1_F2_IO.90), U_LED_BUFFER_1xFPGA2/U_LED_BUFFER9 (R52_U_LED_BUFFER_1xFPGA2_U_LED_BUFFER9.2)
GPIO_69: F3/IO (P1_F3_IO.90), U_LED_BUFFER_1xFPGA3/U_LED_BUFFER9 (R52_U_LED_BUFFER_1xFPGA3_U_LED_BUFFER9.2)
GPIO_69: F4/IO (P1_F4_IO.90), U_LED_BUFFER_1xFPGA4/U_LED_BUFFER9 (R52_U_LED_BUFFER_1xFPGA4_U_LED_BUFFER9.2)
GPIO_70: F1/IO (P1_F1_IO.89), U_LED_BUFFER_1xFPGA1/U_LED_BUFFER9 (R53_U_LED_BUFFER_1xFPGA1_U_LED_BUFFER9.2)
GPIO_70: F2/IO (P1_F2_IO.89), U_LED_BUFFER_1xFPGA2/U_LED_BUFFER9 (R53_U_LED_BUFFER_1xFPGA2_U_LED_BUFFER9.2)
GPIO_70: F3/IO (P1_F3_IO.89), U_LED_BUFFER_1xFPGA3/U_LED_BUFFER9 (R53_U_LED_BUFFER_1xFPGA3_U_LED_BUFFER9.2)
GPIO_70: F4/IO (P1_F4_IO.89), U_LED_BUFFER_1xFPGA4/U_LED_BUFFER9 (R53_U_LED_BUFFER_1xFPGA4_U_LED_BUFFER9.2)
GPIO_71: F1/IO (P1_F1_IO.88), U_LED_BUFFER_1xFPGA1/U_LED_BUFFER9 (R54_U_LED_BUFFER_1xFPGA1_U_LED_BUFFER9.2)
GPIO_71: F2/IO (P1_F2_IO.88), U_LED_BUFFER_1xFPGA2/U_LED_BUFFER9 (R54_U_LED_BUFFER_1xFPGA2_U_LED_BUFFER9.2)
GPIO_71: F3/IO (P1_F3_IO.88), U_LED_BUFFER_1xFPGA3/U_LED_BUFFER9 (R54_U_LED_BUFFER_1xFPGA3_U_LED_BUFFER9.2)
GPIO_71: F4/IO (P1_F4_IO.88), U_LED_BUFFER_1xFPGA4/U_LED_BUFFER9 (R54_U_LED_BUFFER_1xFPGA4_U_LED_BUFFER9.2)
GPIO_72: F1/IO (P1_F1_IO.105), U_LED_BUFFER_1xFPGA1/U_LED_BUFFER10 (R47_U_LED_BUFFER_1xFPGA1_U_LED_BUFFER10.2)
GPIO_72: F2/IO (P1_F2_IO.105), U_LED_BUFFER_1xFPGA2/U_LED_BUFFER10 (R47_U_LED_BUFFER_1xFPGA2_U_LED_BUFFER10.2)
GPIO_72: F3/IO (P1_F3_IO.105), U_LED_BUFFER_1xFPGA3/U_LED_BUFFER10 (R47_U_LED_BUFFER_1xFPGA3_U_LED_BUFFER10.2)
GPIO_72: F4/IO (P1_F4_IO.105), U_LED_BUFFER_1xFPGA4/U_LED_BUFFER10 (R47_U_LED_BUFFER_1xFPGA4_U_LED_BUFFER10.2)
GPIO_73: F1/IO (P1_F1_IO.102), U_LED_BUFFER_1xFPGA1/U_LED_BUFFER10 (R48_U_LED_BUFFER_1xFPGA1_U_LED_BUFFER10.2)
GPIO_73: F2/IO (P1_F2_IO.102), U_LED_BUFFER_1xFPGA2/U_LED_BUFFER10 (R48_U_LED_BUFFER_1xFPGA2_U_LED_BUFFER10.2)
GPIO_73: F3/IO (P1_F3_IO.102), U_LED_BUFFER_1xFPGA3/U_LED_BUFFER10 (R48_U_LED_BUFFER_1xFPGA3_U_LED_BUFFER10.2)
GPIO_73: F4/IO (P1_F4_IO.102), U_LED_BUFFER_1xFPGA4/U_LED_BUFFER10 (R48_U_LED_BUFFER_1xFPGA4_U_LED_BUFFER10.2)
GPIO_74: F1/IO (P1_F1_IO.101), U_LED_BUFFER_1xFPGA1/U_LED_BUFFER10 (R49_U_LED_BUFFER_1xFPGA1_U_LED_BUFFER10.2)
GPIO_74: F2/IO (P1_F2_IO.101), U_LED_BUFFER_1xFPGA2/U_LED_BUFFER10 (R49_U_LED_BUFFER_1xFPGA2_U_LED_BUFFER10.2)
GPIO_74: F3/IO (P1_F3_IO.101), U_LED_BUFFER_1xFPGA3/U_LED_BUFFER10 (R49_U_LED_BUFFER_1xFPGA3_U_LED_BUFFER10.2)
GPIO_74: F4/IO (P1_F4_IO.101), U_LED_BUFFER_1xFPGA4/U_LED_BUFFER10 (R49_U_LED_BUFFER_1xFPGA4_U_LED_BUFFER10.2)
ID0: TOP_LED (R24.1), F1/IO (P1_F1_IO.112)
ID0: TOP_LED (R30.2), F2/IO (P1_F2_IO.112)
ID0: TOP_LED (R32.1), F3/IO (P1_F3_IO.112)
ID0: TOP_LED (R34.2), F4/IO (P1_F4_IO.112)
ID1: TOP_LED (R23.1), F1/IO (P1_F1_IO.123)
ID1: TOP_LED (R25.1), F2/IO (P1_F2_IO.123)
ID1: TOP_LED (R31.2), F3/IO (P1_F3_IO.123)
ID1: TOP_LED (R33.2), F4/IO (P1_F4_IO.123)
TCK: TOP_LED (C36.2 P3.1 R12.2 U8.1), F1/IO (P1_F1_IO.18), F2/IO (P1_F2_IO.18), F3/IO (P1_F3_IO.18), F4/IO (P1_F4_IO.18)
TDI: TOP_LED (C39.2 P3.9 R10.2 U8.4), F1/IO (P1_F1_IO.19)
TDI: F1/IO (P1_F1_IO.20), F2/IO (P1_F2_IO.19)
TDI: F2/IO (P1_F2_IO.20), F3/IO (P1_F3_IO.19)
TDI: F3/IO (P1_F3_IO.20), F4/IO (P1_F4_IO.19)
TDO: TOP_LED (C37.2 P3.3 U8.6), F4/IO (P1_F4_IO.20)
TMS: TOP_LED (C38.2 P3.5 R11.2 U8.3), F1/IO (P1_F1_IO.16), F2/IO (P1_F2_IO.16), F3/IO (P1_F3_IO.16), F4/IO (P1_F4_IO.16)
VCC_FPGA: TOP_LED (R30.1), F2/IO (38 pins), F2/POWER (44 pins)
VCC_FPGA: TOP_LED (R31.1), F3/IO (38 pins), F3/POWER (44 pins)
VCC_FPGA: TOP_LED (R33.1 R34.1), F4/IO (38 pins), F4/POWER (44 pins)
VCC_FPGA: F1/IO (38 pins), F1/POWER (44 pins)
XSIG: F1/IO (P1_F1_IO.26), F2/IO (P1_F2_IO.26), F3/IO (P1_F3_IO.26), F4/IO (P1_F4_IO.26)